# EAGLE board rt10 (EAGLE 9.6.2)
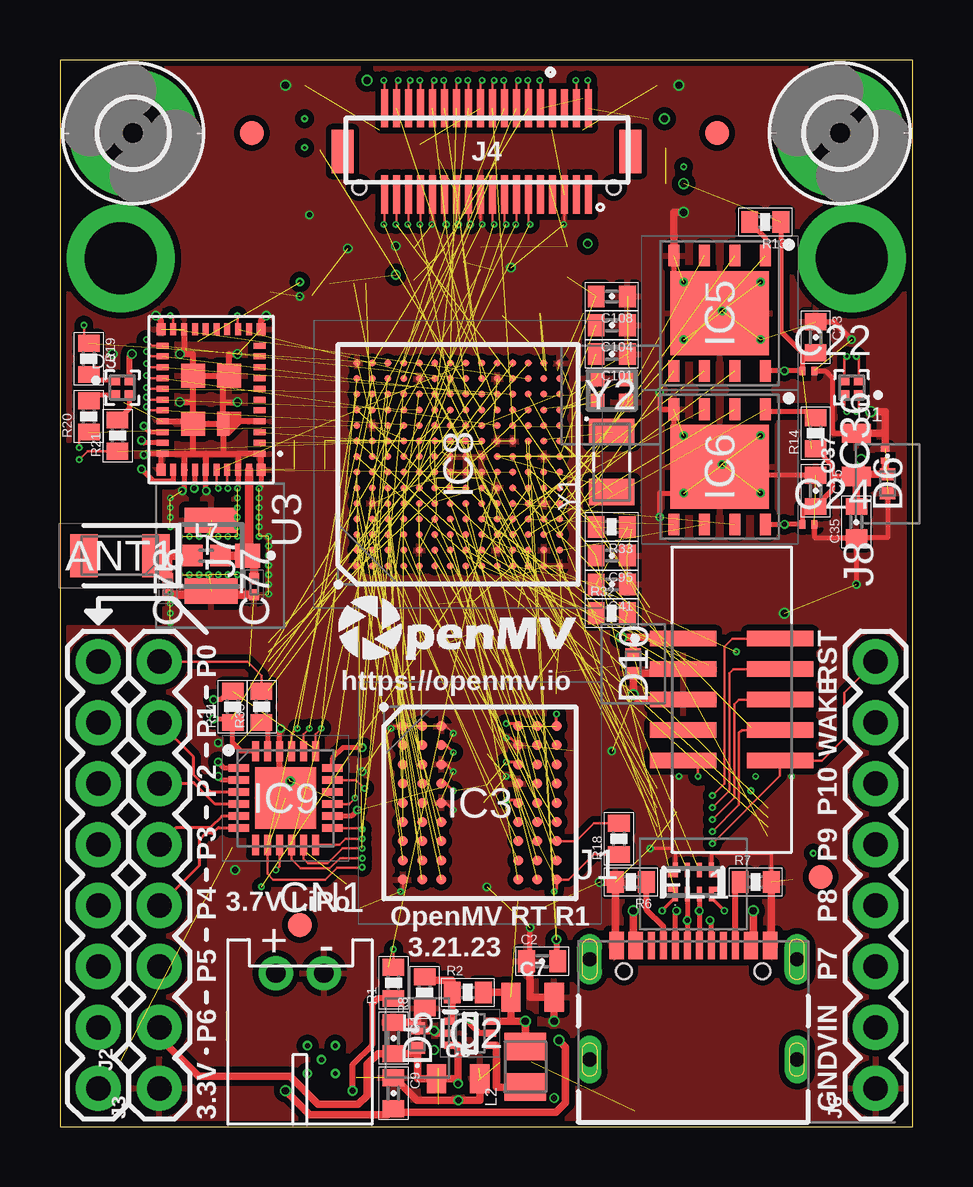
[diagram p5: board, top side]
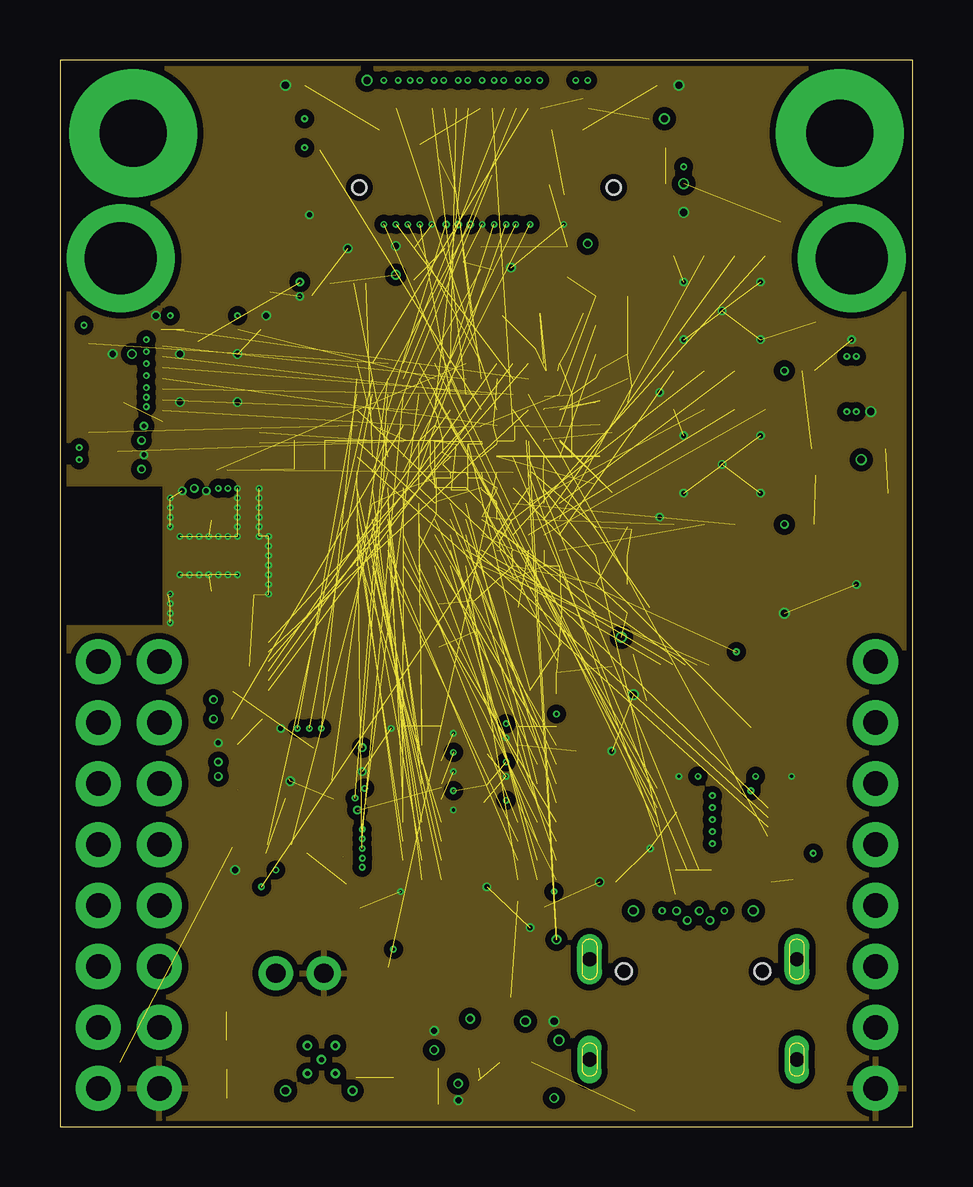
[diagram p6: board, inner layer GND]
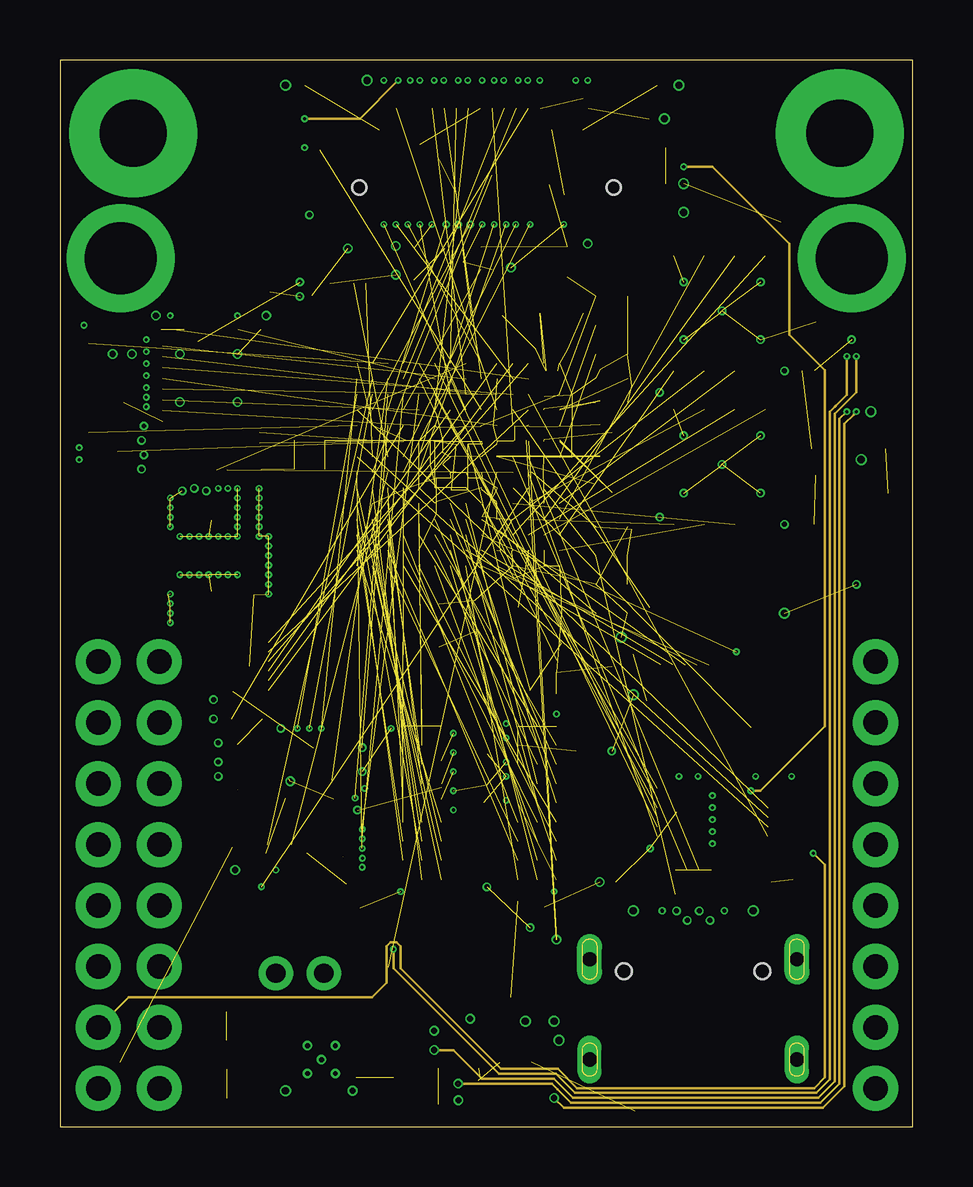
[diagram p7: board, inner layer Route3]
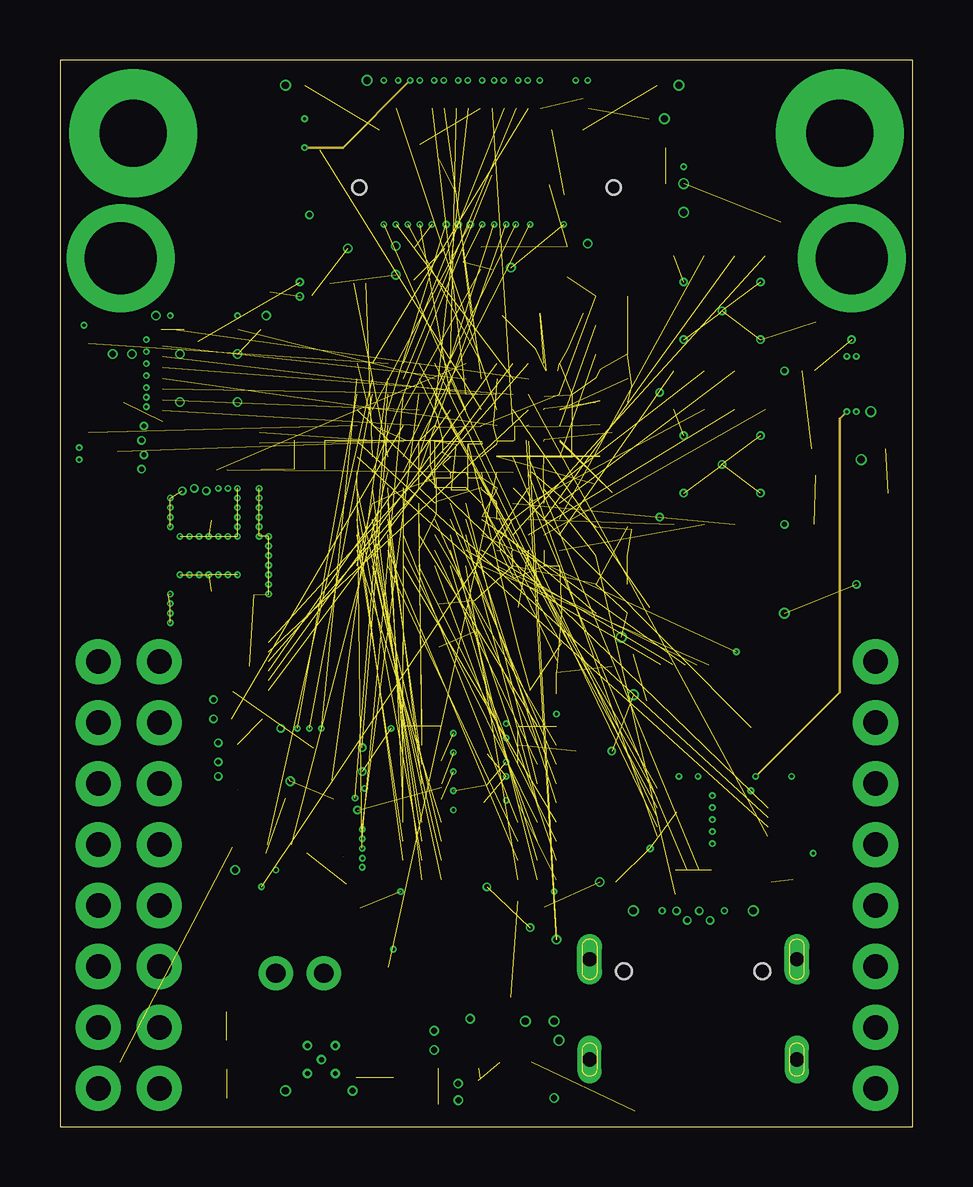
[diagram p8: board, inner layer Route14]
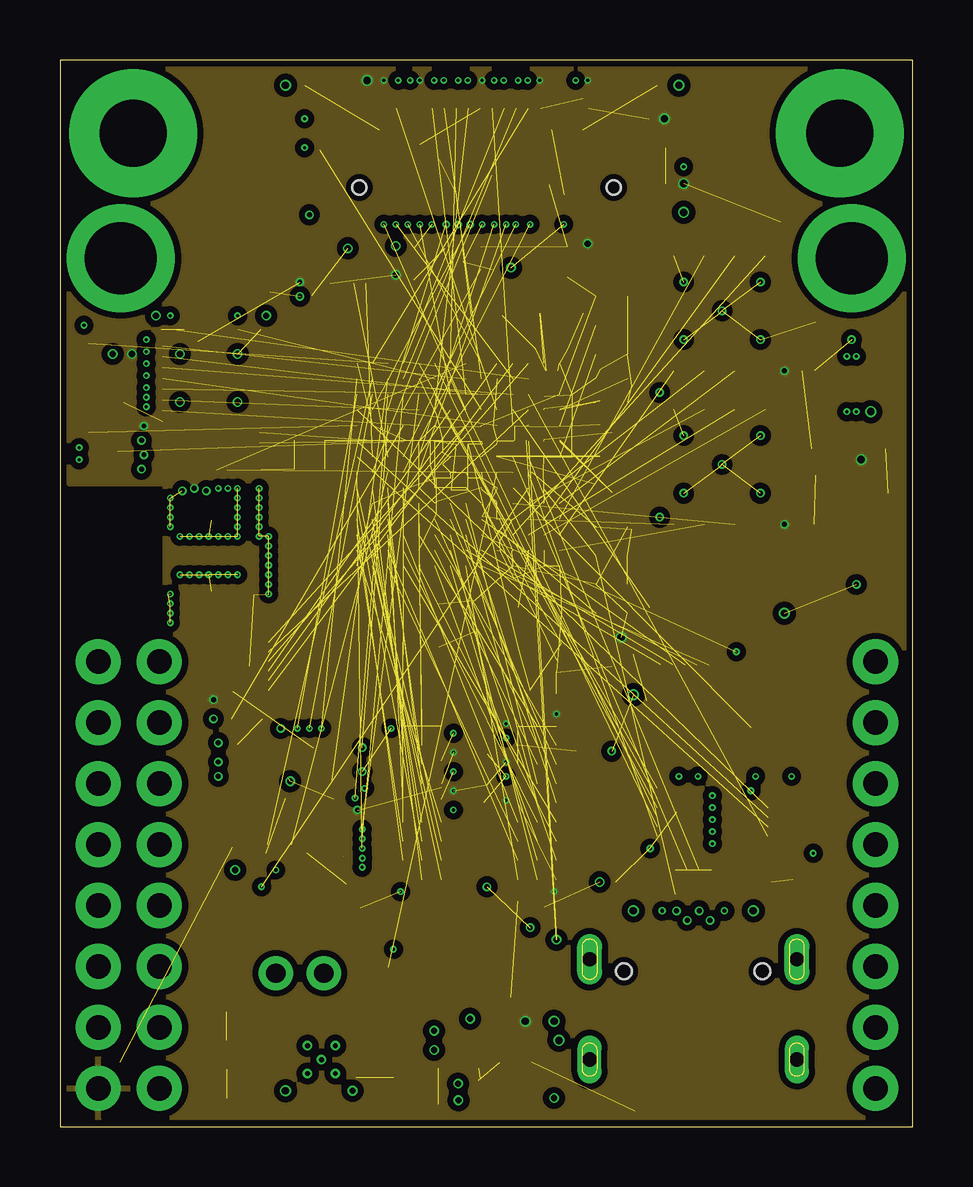
[diagram p9: board, inner layer VCC]
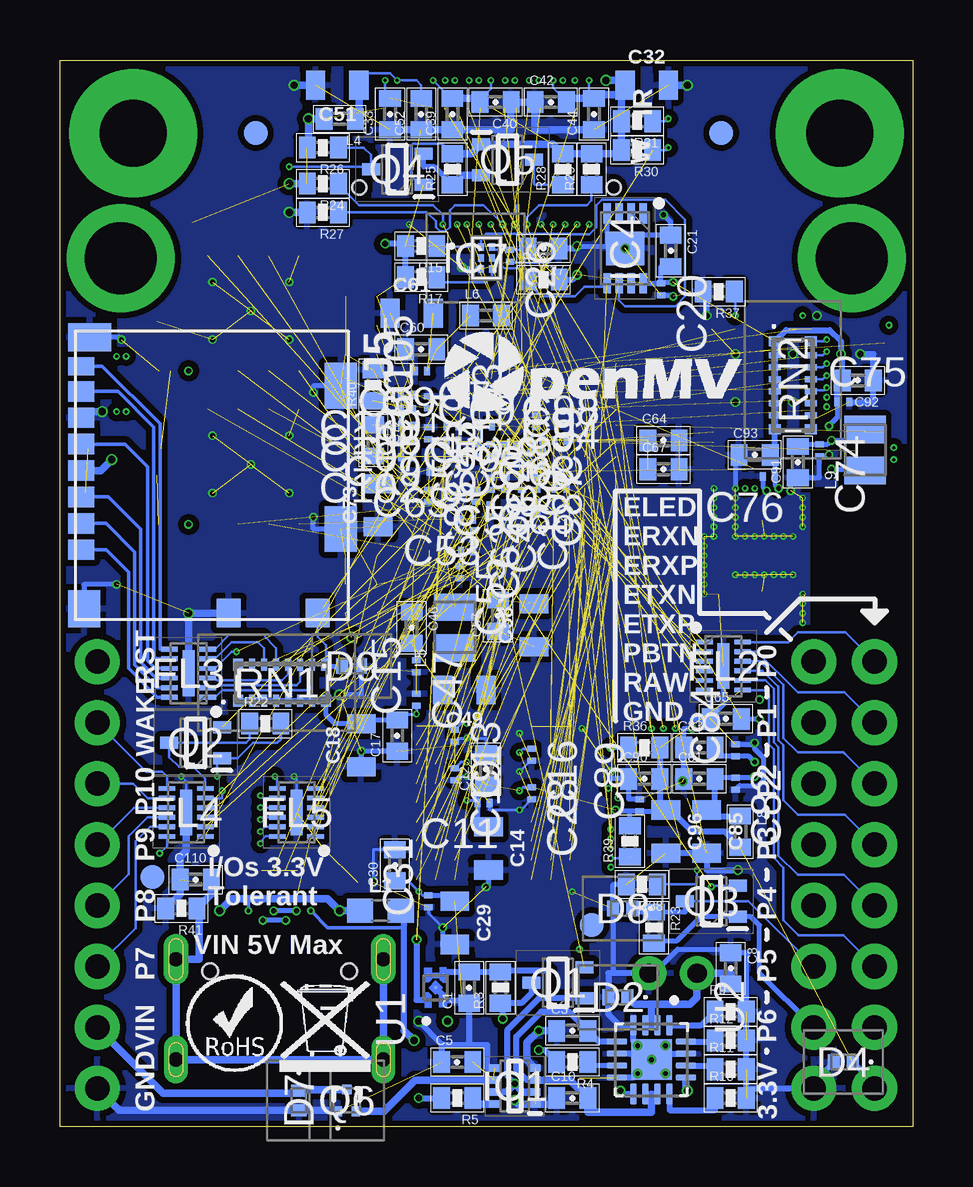
[diagram p10: board, bottom side, seen from below]

Size 35.56 x 44.45 mm. Coordinates in mm from the lower left corner, seen from the top.
Outline: 0,44.45 0,0 35.56,0 35.56,44.45 0,44.45
Copper layers (1*2*3*4*13*14*15*16): Top 0.035mm / dielectric 0.15mm / GND 0.035mm / dielectric 0.25mm / Route3 0.035mm / dielectric 0.15mm / Route4 0.035mm / dielectric 0.25mm / Route13 0.035mm / dielectric 0.15mm / Route14 0.035mm / dielectric 0.25mm / VCC 0.035mm / dielectric 0.15mm / Bottom 0.035mm
Design rules "MF_Ext_4_mil_drill_8_Layer *": minimum track width 3mil, minimum drill 4mil, track to track 3mil, track to pad 3mil, pad to pad 3mil, via to via 3mil, smd to smd 0mil, copper to edge 3mil, drill to drill 3mil, minimum pad ring 3mil, minimum via ring 3mil, stop-mask expansion 2mil, vias tented up to drill 25mil, thermal gap 10mil
Net classes: 0 default: width 0.102 mm, drill 0.127 mm, clearance 0.102 mm; 1 power: width 0.254 mm, drill 0.254 mm, clearance 0.102 mm; 2 gnd: width 0.102 mm, drill 0.127 mm, clearance 0.102 mm; 3 sdram: width 0.102 mm, drill 0.127 mm, clearance 0.102 mm; 4 jtag: width 0.102 mm, drill 0.127 mm, clearance 0.102 mm; 5 dcmi: width 0.102 mm, drill 0.127 mm, clearance 0.102 mm; 6 spi: width 0.102 mm, drill 0.127 mm, clearance 0.102 mm; 7 flash: width 0.102 mm, drill 0.127 mm, clearance 0.102 mm; 9 eth: width 0.102 mm, drill 0.127 mm, clearance 0.102 mm; 10 mdi: width 0.127 mm, drill 0.127 mm, clearance 0.102 mm; 11 wifi: width 0.102 mm, drill 0.127 mm, clearance 0.102 mm; 12 sdcard: width 0.102 mm, drill 0.127 mm, clearance 0.102 mm; 13 i2c: width 0.102 mm, drill 0.127 mm, clearance 0.102 mm; 14 mdio: width 0.102 mm, drill 0.127 mm, clearance 0.102 mm; 15 usb: width 0.102 mm, drill 0.127 mm, clearance 0.102 mm

## Footprints (pad centres in the part's own frame; a part is rotated, then mirrored left to right if it is on the bottom)
ANTC3216X140N = smd 1.15 x 1.8: 1 -1.5,0; 2 1.5,0
0402-CAP = smd 0.7 x 0.9: 1 -0.65,0; 2 0.65,0
0805 = smd 0.8 x 1.2: 1 -0.9,0; 2 0.9,0
C0201 = smd 0.25 x 0.35: 1 -0.25,0; 2 0.25,0
CAPC0603X33N = smd 0.46 x 0.42: 1 -0.33,0; 2 0.33,0
JST-PH-2-THM-RA = drill 0.8 pad 1.422: 1 1,0; 2 -1,0
LED_UHD1110-FKA-CL1A13R3Q1BBQFMF3 = smd 0.4 x 0.4: 1 -0.3,0.3; 2 -0.3,-0.3; 3 0.3,-0.3; 4 0.3,0.3
CPDQT5V0HEHF = smd 0.5 x 0.65: 1 -0.4,0; 2 0.4,0
FIDUCIAL-1X2 = smd 1 x 1: 1 0,0
ECMF024CMX8 = smd 0.2 x 0.6: 1 -0.75,-0.5; 2 -0.25,-0.5; 3 0.25,-0.5; 4 0.75,-0.5; 5 0.75,0.5; 6 0.25,0.5; 7 -0.25,0.5; 8 -0.75,0.5 | smd 0.2 x 0.2: 9 -0.95,0.3; 10 -0.95,-0.3; 11 0.95,-0.3; 12 0.95,0.3
SON40P150X250X65-13N = smd 0.7 x 0.2: 1 -0.8,1; 2 -0.8,0.6; 3 -0.8,0.2; 4 -0.8,-0.2; 5 -0.8,-0.6; 6 -0.8,-1; 7 0.8,-1; 8 0.8,-0.6; 9 0.8,-0.2; 10 0.8,0.2; 11 0.8,0.6; 12 0.8,1 | smd 0.5 x 1.9: 13 0,0
2,8-PAD = drill 2.8 pad 5.334: B2,8 0,0
SOTFL50P160X60-8N = smd 0.475 x 0.3: 1 -0.838,0.75; 2 -0.838,0.25; 3 -0.838,-0.25; 4 -0.838,-0.75; 5 0.838,-0.75; 6 0.838,-0.25; 7 0.838,0.25; 8 0.838,0.75
SOTFL50P162X60-6N = smd 0.492 x 0.3: 1 -0.834,0.5; 2 -0.834,0; 3 -0.834,-0.5; 4 0.834,-0.5; 5 0.834,0; 6 0.834,0.5
BGA54C80P9X9_800X800X120 = smd 0.41 x 0.41: A1 -3.2,3.2; A2 -2.4,3.2; A3 -1.6,3.2; A7 1.6,3.2; A8 2.4,3.2; A9 3.2,3.2; B1 -3.2,2.4; B2 -2.4,2.4; B3 -1.6,2.4; B7 1.6,2.4; B8 2.4,2.4; B9 3.2,2.4; C1 -3.2,1.6; C2 -2.4,1.6; C3 -1.6,1.6; C7 1.6,1.6; C8 2.4,1.6; C9 3.2,1.6; D1 -3.2,0.8; D2 -2.4,0.8; D3 -1.6,0.8; D7 1.6,0.8; D8 2.4,0.8; D9 3.2,0.8; E1 -3.2,0; E2 -2.4,0; E3 -1.6,0; E7 1.6,0; E8 2.4,0; E9 3.2,0; F1 -3.2,-0.8; F2 -2.4,-0.8; F3 -1.6,-0.8; F7 1.6,-0.8; F8 2.4,-0.8; F9 3.2,-0.8; G1 -3.2,-1.6; G2 -2.4,-1.6; G3 -1.6,-1.6; G7 1.6,-1.6; G8 2.4,-1.6; G9 3.2,-1.6; H1 -3.2,-2.4; H2 -2.4,-2.4; H3 -1.6,-2.4; H7 1.6,-2.4; H8 2.4,-2.4; H9 3.2,-2.4; J1 -3.2,-3.2; J2 -2.4,-3.2; J3 -1.6,-3.2; J7 1.6,-3.2; J8 2.4,-3.2; J9 3.2,-3.2
SON50P300X200X60-9N = smd 0.85 x 0.3: 1 -1.45,0.75; 2 -1.45,0.25; 3 -1.45,-0.25; 4 -1.45,-0.75; 5 1.45,-0.75; 6 1.45,-0.25; 7 1.45,0.25; 8 1.45,0.75 | smd 1.4 x 1.6: 9 0,0
SON127P500X595X80-9N = smd 0.9 x 0.45: 1 -2.4,1.905; 2 -2.4,0.635; 3 -2.4,-0.635; 4 -2.4,-1.905; 5 2.4,-1.905; 6 2.4,-0.635; 7 2.4,0.635; 8 2.4,1.905 | smd 3.5 x 4.1: 9 0,0
MXC4005XC = smd 0.25 x 0.3: 1 -0.22,0.46; 2 -0.22,0; 3 -0.22,-0.46; 4 0.22,-0.46; 5 0.22,0; 6 0.22,0.46
BGA196C65P14X14_1000X1000X143 = smd 0.29 x 0.29: A1 -4.225,4.225; A2 -3.575,4.225; A3 -2.925,4.225; A4 -2.275,4.225; A5 -1.625,4.225; A6 -0.975,4.225; A7 -0.325,4.225; A8 0.325,4.225; A9 0.975,4.225; A10 1.625,4.225; A11 2.275,4.225; A12 2.925,4.225; A13 3.575,4.225; A14 4.225,4.225; B1 -4.225,3.575; B2 -3.575,3.575; B3 -2.925,3.575; B4 -2.275,3.575; B5 -1.625,3.575; B6 -0.975,3.575; B7 -0.325,3.575; B8 0.325,3.575; B9 0.975,3.575; B10 1.625,3.575; B11 2.275,3.575; B12 2.925,3.575; B13 3.575,3.575; B14 4.225,3.575; C1 -4.225,2.925; C2 -3.575,2.925; C3 -2.925,2.925; C4 -2.275,2.925; C5 -1.625,2.925; C6 -0.975,2.925; C7 -0.325,2.925; C8 0.325,2.925; C9 0.975,2.925; C10 1.625,2.925; C11 2.275,2.925; C12 2.925,2.925; C13 3.575,2.925; C14 4.225,2.925; D1 -4.225,2.275; D2 -3.575,2.275; D3 -2.925,2.275; D4 -2.275,2.275; D5 -1.625,2.275; D6 -0.975,2.275; D7 -0.325,2.275; D8 0.325,2.275; D9 0.975,2.275; D10 1.625,2.275; D11 2.275,2.275; D12 2.925,2.275; D13 3.575,2.275; D14 4.225,2.275; E1 -4.225,1.625; E2 -3.575,1.625; E3 -2.925,1.625; E4 -2.275,1.625; E5 -1.625,1.625; E6 -0.975,1.625; E7 -0.325,1.625; E8 0.325,1.625; E9 0.975,1.625; E10 1.625,1.625; E11 2.275,1.625; E12 2.925,1.625; E13 3.575,1.625; E14 4.225,1.625; F1 -4.225,0.975; F2 -3.575,0.975; F3 -2.925,0.975; F4 -2.275,0.975; F5 -1.625,0.975; F6 -0.975,0.975; F7 -0.325,0.975; F8 0.325,0.975; F9 0.975,0.975; F10 1.625,0.975; F11 2.275,0.975; F12 2.925,0.975; F13 3.575,0.975; F14 4.225,0.975; G1 -4.225,0.325; G2 -3.575,0.325; G3 -2.925,0.325; G4 -2.275,0.325; G5 -1.625,0.325; G6 -0.975,0.325; G7 -0.325,0.325; G8 0.325,0.325; G9 0.975,0.325; G10 1.625,0.325; G11 2.275,0.325; G12 2.925,0.325; G13 3.575,0.325; G14 4.225,0.325; H1 -4.225,-0.325; H2 -3.575,-0.325; H3 -2.925,-0.325; H4 -2.275,-0.325; H5 -1.625,-0.325; H6 -0.975,-0.325; H7 -0.325,-0.325; H8 0.325,-0.325; H9 0.975,-0.325; H10 1.625,-0.325; H11 2.275,-0.325; H12 2.925,-0.325; H13 3.575,-0.325; H14 4.225,-0.325; J1 -4.225,-0.975; J2 -3.575,-0.975; J3 -2.925,-0.975; J4 -2.275,-0.975; J5 -1.625,-0.975; J6 -0.975,-0.975; J7 -0.325,-0.975; J8 0.325,-0.975; J9 0.975,-0.975; J10 1.625,-0.975; J11 2.275,-0.975; J12 2.925,-0.975; J13 3.575,-0.975; J14 4.225,-0.975; K1 -4.225,-1.625; K2 -3.575,-1.625; K3 -2.925,-1.625; K4 -2.275,-1.625; K5 -1.625,-1.625; K6 -0.975,-1.625; K7 -0.325,-1.625; K8 0.325,-1.625; K9 0.975,-1.625; K10 1.625,-1.625; K11 2.275,-1.625; K12 2.925,-1.625; K13 3.575,-1.625; K14 4.225,-1.625; L1 -4.225,-2.275; L2 -3.575,-2.275; L3 -2.925,-2.275; L4 -2.275,-2.275; L5 -1.625,-2.275; L6 -0.975,-2.275; L7 -0.325,-2.275; L8 0.325,-2.275; L9 0.975,-2.275; L10 1.625,-2.275; L11 2.275,-2.275; L12 2.925,-2.275; L13 3.575,-2.275; L14 4.225,-2.275; M1 -4.225,-2.925; M2 -3.575,-2.925; M3 -2.925,-2.925; M4 -2.275,-2.925; M5 -1.625,-2.925; M6 -0.975,-2.925; M7 -0.325,-2.925; M8 0.325,-2.925; M9 0.975,-2.925; M10 1.625,-2.925; M11 2.275,-2.925; M12 2.925,-2.925; M13 3.575,-2.925; M14 4.225,-2.925; N1 -4.225,-3.575; N2 -3.575,-3.575; N3 -2.925,-3.575; N4 -2.275,-3.575; N5 -1.625,-3.575; N6 -0.975,-3.575; N7 -0.325,-3.575; N8 0.325,-3.575; N9 0.975,-3.575; N10 1.625,-3.575; N11 2.275,-3.575; N12 2.925,-3.575; N13 3.575,-3.575; N14 4.225,-3.575; P1 -4.225,-4.225; P2 -3.575,-4.225; P3 -2.925,-4.225; P4 -2.275,-4.225; P5 -1.625,-4.225; P6 -0.975,-4.225; P7 -0.325,-4.225; P8 0.325,-4.225; P9 0.975,-4.225; P10 1.625,-4.225; P11 2.275,-4.225; P12 2.925,-4.225; P13 3.575,-4.225; P14 4.225,-4.225
QFN50P400X400X90-25N = smd 0.85 x 0.3: 1 -1.95,1.25; 2 -1.95,0.75; 3 -1.95,0.25; 4 -1.95,-0.25; 5 -1.95,-0.75; 6 -1.95,-1.25; 13 1.95,-1.25; 14 1.95,-0.75; 15 1.95,-0.25; 16 1.95,0.25; 17 1.95,0.75; 18 1.95,1.25 | smd 0.3 x 0.85: 7 -1.25,-1.95; 8 -0.75,-1.95; 9 -0.25,-1.95; 10 0.25,-1.95; 11 0.75,-1.95; 12 1.25,-1.95; 19 1.25,1.95; 20 0.75,1.95; 21 0.25,1.95; 22 -0.25,1.95; 23 -0.75,1.95; 24 -1.25,1.95 | smd 2.55 x 2.55: 25 0,0
GCT_USB4105-GF-A = smd 0.6 x 1.15: A1_B12 -3.2,4.755; A4_B9 -2.4,4.755; B1_A12 3.2,4.755; B4_A9 2.4,4.755 | smd 0.3 x 1.15: A5 -1.25,4.755; A6 -0.25,4.755; A7 0.25,4.755; A8 1.25,4.755; B5 1.75,4.755; B6 0.75,4.755; B7 -0.75,4.755; B8 -1.75,4.755 | drill 0.6 pad 1.05 long: S1 -4.32,4.18; S4 4.32,4.18 | drill 0.6 pad 1 long: S2 -4.32,0; S3 4.32,0 | hole 0.65: 2.89,3.68; -2.89,3.68
1X08 = drill 1.016 pad 1.88: 1 0,0; 2 2.54,0; 3 5.08,0; 4 7.62,0; 5 10.16,0; 6 12.7,0; 7 15.24,0; 8 17.78,0
DF12-36-DS = smd 0.3 x 1.6: 1 4.25,-1.8; 2 4.25,1.8; 3 3.75,-1.8; 4 3.75,1.8; 5 3.25,-1.8; 6 3.25,1.8; 7 2.75,-1.8; 8 2.75,1.8; 9 2.25,-1.8; 10 2.25,1.8; 11 1.75,-1.8; 12 1.75,1.8; 13 1.25,-1.8; 14 1.25,1.8; 15 0.75,-1.8; 16 0.75,1.8; 17 0.25,-1.8; 18 0.25,1.8; 19 -0.25,-1.8; 20 -0.25,1.8; 21 -0.75,-1.8; 22 -0.75,1.8; 23 -1.25,-1.8; 24 -1.25,1.8; 25 -1.75,-1.8; 26 -1.75,1.8; 27 -2.25,-1.8; 28 -2.25,1.8; 29 -2.75,-1.8; 30 -2.75,1.8; 31 -3.25,-1.8; 32 -3.25,1.8; 33 -3.75,-1.8; 34 -3.75,1.8; 35 -4.25,-1.8; 36 -4.25,1.8 | smd 0.9 x 1.8: F1 6,0; F2 -6,0 | hole 0.6: 5.3,-1.5; -5.3,-1.5
1040310811 = smd 1.2 x 1: CD$1 11.74,10.1; CD$2 11.74,6.4 | smd 1.55 x 1.35: G$1 11.565,0.375 | smd 1.17 x 1.8: G$2 0.245,0.6 | smd 1.9 x 1.35: G$3 2.27,11.075; G$4 8.24,11.075 | smd 0.85 x 1.1: P$1 9.105,0.25; P$2 8.005,0.25; P$3 6.905,0.25; P$4 5.805,0.25; P$5 4.705,0.25; P$6 3.605,0.25; P$7 2.505,0.25 | smd 0.75 x 1.1: P$8 1.455,0.25
23370191 = smd 1 x 1.05: 1 0,-1.525 | smd 1.05 x 2.2: 2 -1.475,0; 3 1.475,0
CNC_3221-10-0300-00 = smd 0.65 x 2.76: 1 -2.54,-2.02; 2 -2.54,2.02; 3 -1.27,-2.02; 4 -1.27,2.02; 5 0,-2.02; 6 0,2.02; 7 1.27,-2.02; 8 1.27,2.02; 9 2.54,-2.02; 10 2.54,2.02
0603 = smd 1.1 x 1: 1 -0.85,0; 2 0.85,0
INDC2016X100N = smd 1.14 x 1.73: 1 -0.847,0; 2 0.847,0
C0402 = smd 0.7 x 0.9: 1 -0.65,0; 2 0.65,0
0402 = smd 0.85 x 0.9: 1 -0.58,0; 2 0.58,0
9774030151R = drill 3 pad 4.5: P$1 0,0
SOT65P210X110-3N = smd 0.75 x 0.5: 1 -1.1,0.65; 2 -1.1,-0.65; 3 1.1,0
PMXB120EPEZ = smd 0.35 x 0.4: 1 -0.375,-0.45; 2 0.375,-0.45 | smd 0.4 x 0.4: 3 0,0.45
0402-RES = smd 0.7 x 0.9: 1 -0.65,0; 2 0.65,0
EXB2HV104JV = smd 0.425 x 0.5: 1 -1.837,-0.75; 8 1.837,-0.75; 9 1.837,0.75; 16 -1.837,0.75 | smd 0.25 x 0.5: 2 -1.25,-0.75; 3 -0.75,-0.75; 4 -0.25,-0.75; 5 0.25,-0.75; 6 0.75,-0.75; 7 1.25,-0.75; 10 1.25,0.75; 11 0.75,0.75; 12 0.25,0.75; 13 -0.25,0.75; 14 -0.75,0.75; 15 -1.25,0.75
VREG_MIC5365-3.3YMT-TZ = smd 0.1 x 0.1: 1 -0.521,0.312; 2 -0.521,-0.312; 3 0.521,-0.312; 4 0.521,0.312; EP 0,0
QFN50P300X300X100-17N = smd 0.86 x 0.26: 1 -1.435,0.75; 2 -1.435,0.25; 3 -1.435,-0.25; 4 -1.435,-0.75; 9 1.435,-0.75; 10 1.435,-0.25; 11 1.435,0.25; 12 1.435,0.75 | smd 0.26 x 0.86: 5 -0.75,-1.435; 6 -0.25,-1.435; 7 0.25,-1.435; 8 0.75,-1.435; 13 0.75,1.435; 14 0.25,1.435; 15 -0.25,1.435; 16 -0.75,1.435 | smd 1.68 x 1.68: 17 0,0 | drill 0.2 pad 0.4: 18 0,0; 19 -0.58,0.58; 20 0.58,0.58; 21 -0.58,-0.58; 22 0.58,-0.58
XCVR_LBEE5KL1DX-TEMP = smd 0.5 x 0.25: 1 -2.025,2.25; 2 -2.025,1.8; 3 -2.025,1.35; 4 -2.025,0.9; 5 -2.025,0.45; 6 -2.025,0; 7 -2.025,-0.45; 8 -2.025,-0.9; 9 -2.025,-1.35; 10 -2.025,-1.8; 11 -2.025,-2.25; 22 2.025,-2.25; 23 2.025,-1.8; 24 2.025,-1.35; 25 2.025,-0.9; 26 2.025,-0.45; 27 2.025,0; 28 2.025,0.45; 29 2.025,0.9; 30 2.025,1.35; 31 2.025,1.8; 32 2.025,2.25 | smd 0.375 x 0.5: 12 -2.087,-2.925; 21 2.087,-2.925; 33 2.087,2.925; 42 -2.087,2.925 | smd 0.25 x 0.5: 13 -1.575,-2.925; 14 -1.125,-2.925; 15 -0.675,-2.925; 16 -0.225,-2.925; 17 0.225,-2.925; 18 0.675,-2.925; 19 1.125,-2.925; 20 1.575,-2.925; 34 1.575,2.925; 35 1.125,2.925; 36 0.675,2.925; 37 0.225,2.925; 38 -0.225,2.925; 39 -0.675,2.925; 40 -1.125,2.925; 41 -1.575,2.925 | smd 0.5 x 1: 43 -0.5,1 | smd 1 x 1: 44 -0.75,-1; 45 0.75,1; 46 0.75,-1
XTAL_ABS07-32.768KHZ-7-T = smd 1.1 x 1.9: 1 -1.25,0; 2 1.25,0
XRCGB24M000F3M00R0 = smd 0.75 x 0.7: 1 -0.675,-0.5; 2 0.675,-0.5; 3 0.675,0.5; 4 -0.675,0.5

## Placement (x,y rotation side)
ANT1  AMCA31-2R450G-S1F-T3  [ANTC3216X140N]  2.5,23.8 180 top
C1  4.7uF  [0402-CAP]  18.5,5.8 90 bottom
C2  4.7uF  [0402-CAP]  20.1,6.9 0 top
C3  4.7uF  [0402-CAP]  14.2,4 0 bottom
C4  4.7uF  [0402-CAP]  13.9,3.7 270 top
C5  4.7uF  [0402-CAP]  19,2.7 0 bottom
C6  22uF  [0805]  16.6,2 0 top
C7  22uF  [0805]  19.7,5.4 0 top
C8  4.7uF  [0402-CAP]  7.6,6.6 270 bottom
C9  4.7uF  [0402-CAP]  13.9,1.4 270 top
C10  4.7uF  [0402-CAP]  14.2,1.2 0 bottom
C11  0.22uF  [C0201]  17.9,13.5 180 bottom
C12  4.7uF  [0402-CAP]  17.8,14.9 90 bottom
C13  0.22uF  [C0201]  19.1,16.3 270 bottom
C14  22uF  [0805]  17.7,11.6 270 bottom
C15  0.22uF  [C0201]  20.7,17.8 90 bottom
C16  0.22uF  [C0201]  15.9,15.5 270 bottom
C17  4.7uF  [0402-CAP]  21.5,16.3 90 bottom
C18  22uF  [0805]  23,15.9 90 bottom
C19  0.22uF  [C0201]  19.1,14.7 270 bottom
C20  0.22uF  [C0201]  10.5,34.9 270 bottom
C21  4.7uF  [0402-CAP]  10.1,36.5 270 bottom
C22  0.22uF  [C0201]  31.2,31.5 0 top
C23  4.7uF  [0402-CAP]  31.5,32.9 270 top
C24  0.22uF  [C0201]  31.2,25.1 0 top
C25  4.7uF  [0402-CAP]  31.5,26.5 270 top
C26  0.22uF  [C0201]  16.8,36.3 270 bottom
C27  4.7uF  [0402-CAP]  15.4,36.6 180 bottom
C28  0.22uF  [C0201]  15.9,13.9 270 bottom
C29  22uF  [0805]  19.1,8.5 270 bottom
C30  4.7uF  [0402-CAP]  21.6,10.9 90 bottom
C31  0.22uF  [C0201]  20.2,9.4 90 bottom
C32  22uF  [0805]  11.1,43.4 0 bottom
C33  4.7uF  [0402-CAP]  21.8,42.2 90 bottom
C34  0.22uF  [C0201]  17,26.8 90 bottom
C35  4.7uF  [0402-CAP]  33.2,25.2 90 top
C36  0.22uF  [C0201]  34.4,28 90 top
C37  22uF  [0805]  33.2,28 90 top
C38  0.22uF  [C0201]  17,28.2 270 bottom
C39  4.7uF  [0402-CAP]  19.2,42.2 90 bottom
C40  4.7uF  [0402-CAP]  17.4,42.7 180 bottom
C41  4.7uF  [0402-CAP]  23,22.6 180 top
C42  4.7uF  [0402-CAP]  15.1,42.7 0 bottom
C43  0.22uF  [C0201]  17.6,26.8 90 bottom
C44  4.7uF  [0402-CAP]  13.3,42.2 90 bottom
C45  0.22uF  [C0201]  17.6,28.2 270 bottom
C46  4.7uF  [0402-CAP]  20.9,20.8 270 bottom
C47  0.22uF  [C0201]  20.7,19.2 270 bottom
C48  0.22uF  [C0201]  17.6,25.7 270 bottom
C49  22uF  [0805]  18.7,18.2 180 bottom
C50  0.22uF  [C0201]  17.8,29.2 180 bottom
C51  22uF  [0805]  24,43.4 180 bottom
C52  4.7uF  [0402-CAP]  20.5,42.2 90 bottom
C53  0.22uF  [C0201]  18.6,25.3 180 bottom
C54  0.22uF  [C0201]  18.2,26.3 90 bottom
C55  0.22uF  [C0201]  18.9,23.1 270 bottom
C56  0.22uF  [C0201]  18.6,24 0 bottom
C57  4.7uF  [0402-CAP]  17.3,21.3 90 bottom
C58  22uF  [0805]  15.8,20.9 90 bottom
C59  0.22uF  [C0201]  20.5,31.5 180 bottom
C60  4.7uF  [0402-CAP]  20.5,32.4 0 bottom
C61  22uF  [0805]  20.9,33.9 0 bottom
C62  0.22uF  [C0201]  18.3,24.6 270 bottom
C63  0.22uF  [C0201]  19.9,27.3 180 bottom
C64  4.7uF  [0402-CAP]  10.4,28.6 0 bottom
C65  4.7uF  [0402-CAP]  7.8,17 0 bottom
C66  0.22uF  [C0201]  14.7,26.6 180 bottom
C67  4.7uF  [0402-CAP]  10.4,27.4 0 bottom
C68  0.22uF  [C0201]  14.7,28.6 180 bottom
C69  0.22uF  [C0201]  19.2,28.6 0 bottom
C70  0.22uF  [C0201]  19.2,29.2 0 bottom
C71  0.22uF  [C0201]  18.2,28.2 90 bottom
C72  4.7uF  [0402-CAP]  22.5,28.6 270 bottom
C73  22uF  [0805]  22.3,25.9 90 bottom
C74  0.22uF  [C0201]  3.9,28.2 270 bottom
C75  0.22uF  [C0201]  2.9,30.2 0 bottom
C76  0.22uF  [C0201]  6,27.1 180 bottom
C77  GRM0335C1H1R5BA01D  [CAPC0603X33N]  8.1,22.5 270 top
C78  DNP  [CAPC0603X33N]  4.5,22.5 270 top
C79  18pF  [C0201]  21.1,28.6 180 bottom
C80  18pF  [C0201]  20.2,28.9 90 bottom
C81  4.7uF  [0402-CAP]  8.9,14.5 0 bottom
C82  0.22uF  [C0201]  7.4,14.3 270 bottom
C83  4.7uF  [0402-CAP]  8.9,15.8 0 bottom
C84  0.22uF  [C0201]  7.4,15.7 90 bottom
C85  22uF  [0805]  8.6,12.3 270 bottom
C86  0.22uF  [C0201]  15.7,25.8 90 bottom
C87  0.22uF  [C0201]  15.7,26.8 270 bottom
C88  0.22uF  [C0201]  20.2,26.3 270 bottom
C89  0.22uF  [C0201]  11.4,13.4 90 bottom
C90  4.7uF  [0402-CAP]  11.2,14.5 0 bottom
C91  4.7uF  [0402-CAP]  4.8,27.7 90 bottom
C92  4.7uF  [0402-CAP]  2.3,31.1 180 bottom
C93  4.7uF  [0402-CAP]  6.6,28 0 bottom
C94  0.22uF  [C0201]  15.7,27.6 0 bottom
C95  4.7uF  [0402-CAP]  23,23.8 180 top
C96  22uF  [0805]  10.3,12.3 270 bottom
C97  0.22uF  [C0201]  15.7,28.1 0 bottom
C98  0.22uF  [C0201]  15.7,28.6 0 bottom
C99  0.22uF  [C0201]  15.7,29.4 270 bottom
C100  0.22uF  [C0201]  16.3,26.8 270 bottom
C101  4.7uF  [0402-CAP]  23,32.2 180 top
C102  0.22uF  [C0201]  21.1,27.9 180 bottom
C103  0.22uF  [C0201]  16.5,28.2 90 bottom
C104  4.7uF  [0402-CAP]  23,33.4 180 top
C105  4.7pF  [C0201]  20.2,30.2 90 bottom
C106  4.7pF  [C0201]  21.1,29.9 180 bottom
C107  0.22uF  [C0201]  21.1,29.2 180 bottom
C108  4.7uF  [0402-CAP]  23,34.6 180 top
C109  0.22uF  [C0201]  21.1,30.5 180 bottom
C110  1nF  [0402-CAP]  29.9,10.3 0 bottom
CN1  S2B-PH-K-S(LF)(SN)  [JST-PH-2-THM-RA]  10,6.4 180 top
D1  UHD1110-FKA-CL1A13R3Q1BBQFMF3  [LED_UHD1110-FKA-CL1A13R3Q1BBQFMF3]  33,30.8 180 top
D2  CPDQT5V0HE-HF  [CPDQT5V0HEHF]  12.3,5.4 180 bottom
D3  UHD1110-FKA-CL1A13R3Q1BBQFMF3  [LED_UHD1110-FKA-CL1A13R3Q1BBQFMF3]  2.6,30.8 0 top
D4  CPDQT5V0HE-HF  [CPDQT5V0HEHF]  2.9,2.7 180 bottom
D5  CPDQT5V0HE-HF  [CPDQT5V0HEHF]  14.9,3.7 90 top
D6  CPDQT5V0HE-HF  [CPDQT5V0HEHF]  34.5,26.8 270 top
D7  CPDQT5V0HE-HF  [CPDQT5V0HEHF]  25.6,1.1 270 bottom
D8  CPDQT5V0HE-HF  [CPDQT5V0HEHF]  12.1,9.1 180 bottom
D9  CPDQT5V0HE-HF  [CPDQT5V0HEHF]  23.4,19.2 0 bottom
D10  CPDQT5V0HE-HF  [CPDQT5V0HEHF]  23.9,19.3 270 top
FD1  FIDUCIAL1X2  [FIDUCIAL-1X2]  10,8.4 0 top
FD2  FIDUCIAL1X2  [FIDUCIAL-1X2]  31.7,10.4 0 top
FD3  FIDUCIAL1X2  [FIDUCIAL-1X2]  8,41.4 0 bottom
FD4  FIDUCIAL1X2  [FIDUCIAL-1X2]  31.7,10.4 0 bottom
FD5  FIDUCIAL1X2  [FIDUCIAL-1X2]  27.4,41.4 0 top
FD6  FIDUCIAL1X2  [FIDUCIAL-1X2]  8,41.4 0 top
FD7  FIDUCIAL1X2  [FIDUCIAL-1X2]  27.4,41.4 0 bottom
FD8  FIDUCIAL1X2  [FIDUCIAL-1X2]  13.4,8.4 0 bottom
FL1  ECMF02-4CMX8  [ECMF024CMX8]  26.4,10.2 0 top
FL2  EMIF06-1005M12  [SON40P150X250X65-13N]  7.9,19.2 0 bottom
FL3  EMIF06-1005M12  [SON40P150X250X65-13N]  30.2,18.9 180 bottom
FL4  EMIF06-1005M12  [SON40P150X250X65-13N]  30.3,13.1 180 bottom
FL5  EMIF06-1005M12  [SON40P150X250X65-13N]  25.7,13.1 180 bottom
H1  MOUNT-PAD-ROUND2.8  [2,8-PAD]  3.05,41.4 90 top
H2  MOUNT-PAD-ROUND2.8  [2,8-PAD]  32.51,41.4 270 top
IC1  LM66200DRLR  [SOTFL50P160X60-8N]  16.6,1.7 180 bottom
IC2  AP61300Z6-7  [SOTFL50P162X60-6N]  17.1,3.9 0 top
IC3  IS42S16160G-6BL  [BGA54C80P9X9_800X800X120]  17.5,13.5 0 top
IC4  ATECC608B-MAHDA-T  [SON50P300X200X60-9N]  12,36.6 270 bottom
IC5  IS25LP064D-JKLE-TR  [SON127P500X595X80-9N]  27.5,33.9 270 top
IC6  IS25LP128F-JKLE-TR  [SON127P500X595X80-9N]  27.5,27.5 270 top
IC7  MXC4005XC  [MXC4005XC]  17.78,36.2 0 bottom
IC8  MIMXRT1052DVL6B  [BGA196C65P14X14_1000X1000X143]  16.6,27.6 90 top
IC9  KSZ8081RNDCA-TR  [QFN50P400X400X90-25N]  9.4,13.7 0 top
J1  USB4105-GF-A  [GCT_USB4105-GF-A]  26.4,2.8 0 top
J2  DNP  [1X08]  1.6,1.6 90 top
J3  DNP  [1X08]  4.14,1.6 90 top
J4  DF12-36-DS  [DF12-36-DS]  17.78,40.64 0 top
J5  USD-1040310811  [1040310811]  34.92,33.15 270 bottom
J6  DNP  [1X08]  34,1.6 90 top
J7  DNP  [23370191]  6.3,23.8 90 top
J8  3221-10-0300-00  [CNC_3221-10-0300-00]  28,17.8 270 top
L1  100  [0603]  22.2,9 0 bottom
L2  MAKK2016T1R0M  [INDC2016X100N]  19.4,2.5 90 top
L4  100  [C0402]  23.9,42 180 bottom
L5  MAKK2016T4R7M  [INDC2016X100N]  19.1,20.8 90 bottom
L6  100  [C0402]  17.8,33.8 0 bottom
L7  3.9NH  [0402]  6.1,23.8 0 top
L8  100  [C0402]  7.2,12.3 270 bottom
L9  MAKK2016T2R2M  [INDC2016X100N]  2,28.2 90 bottom
M1  9774030151R  [9774030151R]  33.02,36.2 0 top
M2  9774030151R  [9774030151R]  2.54,36.2 0 top
Q1  2N7002KW_R1_00001  [SOT65P210X110-3N]  14.8,6 180 bottom
Q2  2N7002KW_R1_00001  [SOT65P210X110-3N]  29.9,16 180 bottom
Q3  2N7002KW_R1_00001  [SOT65P210X110-3N]  8.4,9.4 180 bottom
Q4  2N7002KW_R1_00001  [SOT65P210X110-3N]  21.5,39.9 180 bottom
Q5  2N7002KW_R1_00001  [SOT65P210X110-3N]  16.9,40.3 0 bottom
Q6  PMXB120EPEZ  [PMXB120EPEZ]  23.6,1.1 0 bottom
R1  1K  [0402-RES]  13.9,6 90 top
R2  200K  [0402-RES]  17,5.6 0 top
R3  100K  [0402-RES]  17.2,5.8 90 bottom
R4  1K  [0402-RES]  14.2,2.7 180 bottom
R5  1K  [0402-RES]  19,1.2 180 bottom
R6  5.1K  [0402-RES]  23.8,10.2 180 top
R7  5.1K  [0402-RES]  29,10.2 0 top
R8  44.2K  [0402-RES]  15.2,5.6 90 top
R9  10K  [0402-RES]  7.6,4.8 0 bottom
R10  3.3K  [0402-RES]  7.6,1.2 0 bottom
R11  46.4K  [0402-RES]  7.6,2.4 0 bottom
R12  8.2K  [0402-RES]  7.6,3.6 0 bottom
R13  100K  [0402-RES]  29.4,37.7 180 top
R14  100K  [0402-RES]  31.5,28.9 90 top
R15  2.7K  [0402-RES]  20.5,36.7 180 bottom
R16  2.7K  [0402-RES]  15.4,35.3 0 bottom
R17  2.7K  [0402-RES]  20.5,35.4 180 bottom
R18  100K  [0402-RES]  23.3,12 90 top
R19  220  [0402-RES]  1.2,32 270 top
R20  220  [0402-RES]  1.2,29.6 90 top
R21  220  [0402-RES]  2.4,28.8 90 top
R22  100K  [0402-RES]  27,16.8 0 bottom
R23  100K  [0402-RES]  10.8,8.3 270 bottom
R24  100K  [0402-RES]  24.6,39.3 180 bottom
R25  100K  [0402-RES]  19.2,39.9 90 bottom
R26  1K  [0402-RES]  24.6,40.8 180 bottom
R27  100K  [0402-RES]  24.6,38.1 180 bottom
R28  100K  [0402-RES]  14.6,39.9 90 bottom
R29  100K  [0402-RES]  13.4,39.9 90 bottom
R30  4.7K  [0402-RES]  11.5,40.7 180 bottom
R31  4.7K  [0402-RES]  11.5,41.9 180 bottom
R32  30K  [0402-RES]  23,21.4 0 top
R33  10K  [0402-RES]  23,25 180 top
R34  100K  [0402-RES]  7.2,17.5 90 top
R35  220  [0402-RES]  8.4,17.5 90 top
R36  1K  [0402-RES]  11.2,15.8 0 bottom
R37  10K  [0402-RES]  8.1,34.8 180 bottom
R38  6.49K  [0402-RES]  11.3,10.1 180 bottom
R39  1K  [0402-RES]  11.8,11.9 90 bottom
R40  2.2M  [0402-RES]  22.5,30.9 90 bottom
R41  1M  [0402-RES]  30.5,9.1 180 bottom
RN1  EXB-2HV104JV  [EXB2HV104JV]  26.3,18.5 0 bottom
RN2  EXB-2HV104JV  [EXB2HV104JV]  5,30.9 270 bottom
U1  MIC5365-3.3YMT-TZ  [VREG_MIC5365-3.3YMT-TZ]  19.9,5.8 90 bottom
U2  BQ24075RGTR  [QFN50P300X300X100-17N]  10.9,2.8 270 bottom
U3  LBEE5KL1DX-883  [XCVR_LBEE5KL1DX-TEMP]  6.3,30.3 180 top
U$1  [WEEE]  26.4,2.3 0 bottom
U$2  [ROHS]  30.3,2.3 0 bottom
U$3  [OMV-LOGO]  19.68,29.59 0 bottom
U$4  [OMV-LOGO-SMALL]  11.5,19.3 0 top
Y1  SC32S-7PF20PPM  [XTAL_ABS07-32.768KHZ-7-T]  23,27.7 90 top
Y2  XRCGB24M000F3M00R0  [XRCGB24M000F3M00R0]  23,30.7 0 top

## Tracks (layer width: path | path; a pad name or v marks a point on that pad's centre or on a via)
ANT
  Top 0.35: U3.41 7.88,23.85 J7.1 | J7.1 L7.2 | J7.1 8.1,23.52 C77.1
BAT
  Bottom 0.254: U2.2 10.9,4.24 U2.3
  Bottom 0.305: C8.2 7.6,6.4 CN1.1 9,5.4 9.3,5.1 10.9,5.1 | 10.9,5.1 10.9,4.24 | D2.1 11.6,5.1 10.9,5.1
BT_D_WAKE  (via drill 0.13)  (1 unrouted)
  Top 0.102: U3.39 6.97,26.62 v7,26.6
BT_H_WAKE  (via drill 0.13)  (1 unrouted)
  Top 0.102: U3.38 6.53,26.68 v6.6,26.6
BT_REG_ON  (via drill 0.13)  (1 unrouted)
  Top 0.102: U3.14 7.4,33.25 v7.4,33.8
  Bottom 0.102: R37.1 7.4,34.75 v7.4,33.8
BT_UART_RX  (1 unrouted)
BT_UART_TX  (1 unrouted)
CC1
  Top 0.254: J1.A5 25.15,8.35 24.45,9.05 R6.1
CC2
  Top 0.254: J1.B5 28.15,10 R7.1
CHG  (via drill 0.25)
  Top 0.254: v12.2,1.5 12.2,2.6 13,3.4 13,5.1 13.25,5.35 R1.1
  Bottom 0.254: U2.9 12.06,1.36 v12.2,1.5
D_N  (via drill 0.2)
  Top 0.203: FL1.3 v26.65,9 J1.A7 | J1.B7 25.65,8.95 v25.7,9
  Bottom 0.203: v25.7,9 v26.65,9
D_P  (via drill 0.2)
  Top 0.203: FL1.2 v26.15,8.6 J1.A6 | J1.B6 27.15,8.55 v27.1,8.6
  Bottom 0.203: v26.15,8.6 v27.1,8.6
DCDC_LP  (2 unrouted)
DCDC_PSWITCH  (2 unrouted)
DCMI_CLK  (via drill 0.13)  (1 unrouted)
  Top 0.102: J4.12 19.53,43.57 v19.5,43.6
DCMI_D0  (via drill 0.13)  (1 unrouted)
  Top 0.102: J4.31 14.53,37.63 v14.5,37.6
DCMI_D1  (via drill 0.13)  (1 unrouted)
  Top 0.102: J4.29 15.03,37.63 v15,37.6
DCMI_D2  (via drill 0.13)  (1 unrouted)
  Top 0.102: J4.35 13.53,37.63 v13.5,37.6
DCMI_D3  (via drill 0.13)  (1 unrouted)
  Top 0.102: J4.28 15.53,43.53 v15.6,43.6
DCMI_D4  (via drill 0.13)  (1 unrouted)
  Top 0.102: J4.26 16.03,43.57 v16,43.6
DCMI_D5  (via drill 0.13)  (1 unrouted)
  Top 0.102: J4.33 14.03,37.63 v14,37.6
DCMI_D6  (via drill 0.13)  (1 unrouted)
  Top 0.102: J4.24 16.53,43.53 v16.6,43.6
DCMI_D7  (via drill 0.13)  (1 unrouted)
  Top 0.102: J4.22 17.03,43.57 v17,43.6
DCMI_FSIN  (via drill 0.15)  (1 unrouted)
  Top 0.102: J4.23 16.53,37.67 v16.6,37.6
  Bottom 0.102: Q5.3 15.8,39.3 15.75,39.25 R28.1 | v16.6,37.6 16.5,37.7 16.5,38.4
DCMI_HSYNC  (via drill 0.13)  (1 unrouted)
  Top 0.102: J4.18 18.03,43.53 v18.1,43.6
DCMI_MISO  (via drill 0.13)  (1 unrouted)
  Top 0.102: J4.15 18.53,37.67 v18.6,37.6
DCMI_MOSI  (via drill 0.13)  (1 unrouted)
  Top 0.102: J4.17 18.03,37.67 v18.1,37.6
DCMI_PCLK  (via drill 0.13)  (1 unrouted)
  Top 0.102: J4.14 19.03,43.53 v19.1,43.6
DCMI_PWDN  (via drill 0.15)  (1 unrouted)
  Top 0.102: J4.25 16.03,37.67 v16.1,37.6
  Bottom 0.102: R29.1 13.4,38.6 13.6,38.4 15.6,38.4 16.1,37.9 v16.1,37.6
DCMI_RST  (via drill 0.15)  (1 unrouted)
  Top 0.102: J4.21 17.03,37.67 v17.1,37.6
  Bottom 0.102: v17.1,37.6 17.9,38.4 19.1,38.4 19.31,38.19 19.31,37.48 19.48,37.31 19.72,37.31 19.89,37.48 19.89,37.72 20.27,38.1 R27.1
DCMI_SCL  (via drill 0.13)  (1 unrouted)
  Top 0.102: J4.32 14.53,43.53 v14.6,43.6
  Route14 0.102: v14.6,43.6 11.8,40.8 v10.2,40.8
  Bottom 0.102: R30.1 10.3,40.7 v10.2,40.8
DCMI_SCLK  (via drill 0.13)  (1 unrouted)
  Top 0.102: J4.13 19.03,37.63 v19,37.6
DCMI_SDA  (via drill 0.13)  (1 unrouted)
  Top 0.102: J4.34 14.03,43.53 v14.1,43.6
  Route3 0.102: v10.2,42 12.5,42 v14.1,43.6
  Bottom 0.102: R31.1 10.3,41.9 v10.2,42
DCMI_SSEL  (via drill 0.13)  (1 unrouted)
  Top 0.102: J4.11 19.53,37.67 v19.6,37.6
  Bottom 0.102: R24.1 23.95,39.25 23.1,38.4 20,38.4 19.6,38 v19.6,37.6
DCMI_VSYNC  (via drill 0.13)  (1 unrouted)
  Top 0.102: J4.16 18.53,43.57 v18.5,43.6
EN  (via drill 0.25)
  Top 0.254: IC2.5 17.5,3.9 17.1,4.3 v17.1,4.5
  Bottom 0.254: v17.1,4.5 17.1,5.15 | 17.1,5.15 R3.1 | Q1.3 15.9,5.57 16.32,5.15 17.1,5.15
ETH_INT  (via drill 0.2)  (1 unrouted)
  Top 0.203: v12.6,15.8 11.8,15.8 11.35,15.35 IC9.18
  Bottom 0.203: R36.1 v12.6,15.8
ETH_LED
  Top 0.203: R35.1 8.65,16.6 IC9.23
ETH_MDC  (via drill 0.13)  (1 unrouted)
  Top 0.102: IC9.11 10.15,11.16 10.34,10.97 11.16,10.97 11.79,11.6 v12.6,11.6
ETH_MDIO  (via drill 0.13)  (2 unrouted)
  Top 0.102: IC9.10 9.65,11.15 10.03,10.77 11.24,10.77 11.67,11.19 v12.61,11.19
  Bottom 0.102: v12.61,11.19 11.86,11.19 R39.1
ETH_RST  (via drill 0.2)  (1 unrouted)
  Top 0.203: IC9.24 7.55,15.65 7.2,16 R34.1 7.05,17 v6.4,17
  Bottom 0.203: C65.2 v6.4,17
ETH_RXD0  (via drill 0.13)  (1 unrouted)
  Top 0.102: IC9.13 12.55,12.45 v12.6,12.4
ETH_RXD1  (via drill 0.13)  (1 unrouted)
  Top 0.102: IC9.12 11.65,11.75 11.9,12 v12.6,12
ETH_RXDV  (via drill 0.13)  (1 unrouted)
  Top 0.102: IC9.15 12.05,13.45 v12.3,13.7
ETH_RXERR  (via drill 0.13)  (1 unrouted)
  Top 0.102: IC9.17 12.35,14.45 v12.7,14.1
ETH_TXCLK  (via drill 0.13)  (1 unrouted)
  Top 0.102: v12.6,10.81 v12.6,10.8 11.56,10.8 11.06,10.3 8.89,10.3 8.65,10.54 IC9.8
ETH_TXD0  (via drill 0.13)  (1 unrouted)
  Top 0.102: IC9.20 10.15,16.35 v10.4,16.6
ETH_TXD1  (via drill 0.13)  (1 unrouted)
  Top 0.102: IC9.21 9.65,16.35 v9.9,16.6
ETH_TXEN  (via drill 0.13)  (1 unrouted)
  Top 0.102: IC9.19 10.65,16.35 v10.9,16.6
ETH_VDD_1.2  (via drill 0.2)
  Top 0.203: IC9.1 6.85,14.95 v6.6,15.2
  Bottom 0.203: v6.6,15.2 6.85,15.45 C84.1 8.25,15.45 C83.2
ETH_VDDA_3.3  (via drill 0.2)
  Top 0.203: IC9.2 6.75,14.45 v6.6,14.6
  Bottom 0.203: C81.2 8.2,14.55 C82.1 6.65,14.55 v6.6,14.6
  Bottom 0.254: L8.1 8.35,12.95 C85.1 8.25,13.55 C81.2
FB
  Top 0.305: R8.2 15.2,6.1 16.35,6.1 R2.1 16.35,4.4 IC2.1
FEED
  Top 0.35: L7.1 4.4,23.8 | 4.4,23.8 ANT1.1 | C78.1 4.5,23.7 4.4,23.8
GND  (via drill 0.13, 0.15, 0.2, 0.25, 0.3)  (173 unrouted)
  Top 0.102: J4.19 17.53,37.67 v17.6,37.6 | J4.5 21.03,37.63 v21,37.6 | J4.27 15.53,37.63 v15.5,37.6 | IC3.A3 16.1,16.7 v16.4,16.4 | IC3.A1 13.9,16.7 v13.8,16.6 | IC3.J1 14.3,9.9 v14.2,9.8
  Top 0.127: IC3.C3 16.1,15.1 v16.4,14.8 | IC3.E3 16.1,13.5 v16.4,13.2 | v18.6,16.2 18.8,16.2 IC3.B7 | IC3.D7 18.8,14.6 v18.6,14.6
  Top 0.152: FL1.8 25.65,11.4 25.45,11.6 v24.6,11.6 | FL1.5 27.15,11.4 29.65,11.4 R7.2
  Top 0.203: U3.40 7.42,26.62 v7.4,26.6 | U3.42 8.39,26.69 v8.3,26.6 | v3.5,28 3.55,28.05 U3.32 4.21,27.99 U3.33 | v6.1,26.5 6.08,26.52 U3.37 | U3.35 5.17,26.57 v5.1,26.5 | IC9.22 9.15,16.55 v9.2,16.6 | IC5.4 25.6,35.2 26.9,33.9 IC5.9 | C25.1 29.25,27.15 28.9,27.5 IC6.9 26.9,27.5 25.59,28.8 IC6.4 25,29.9 v25,30.6 | C23.1 32.25,33.55 v33,32.8 | C2.1 19.6,7.05 v19.6,8.3 | C22.2 31.9,31.5 32.2,31.2 32.2,28.9 C37.2 | D6.2 34.5,24.55 C35.1 | C24.2 31.45,24.55 C35.1 | C35.1 v33.2,22.6 | v25,25.4 25,26.4 v26,26.4
  Top 0.254: U3.45 5.55,30.2 | 5.55,30.2 v5,30.2 | U3.46 5.55,32.2 v5,32.2 5.17,32.2 U3.19 | U3.43 6.8,30.2 | 6.8,30.2 v7.4,30.2 | U3.44 7.05,32.2 v7.4,32.2 | 7.42,28.05 U3.1 8.39,28.05 U3.42 | 7.42,28.05 U3.40 | U3.4 7.2,29.4 | 7.2,29.4 6.8,29.4 U3.43 | U3.32 5.2,28.05 | 5.2,28.05 5.55,28.05 | 5.55,28.05 U3.45 | U3.35 5.2,27.38 5.2,28.05 | 5.55,28.05 6.08,28.05 | 6.08,28.05 U3.37 | 6.08,28.05 6.8,28.05 | 6.8,28.05 7.42,28.05 | U3.43 6.8,28.05 | 6.8,30.2 6.8,31.3 U3.44 | 5.55,30.2 U3.46 | U3.45 7.2,29.3 7.2,29.4 | U3.46 U3.44 | U3.29 5.55,29.4 U3.45 | U3.21 4.21,33.59 v4,33.8 | U3.12 8.39,33.59 v8.6,33.8 | IC9.22 9.15,13.7 IC9.25
  Top 0.305: D5.2 14.9,4 v15.6,4 15.7,3.9 IC2.2 | C4.1 14.9,4.35 D5.2 | C9.1 13.94,2.05 14.88,1.11 v16.61,1.11 17.5,1.11 C6.2 | D5.2 14.9,4.95 R8.1 | v20.6,4.4 C7.2 19.6,5.4 19.6,6.9 C2.1 | J1.A1_B12 23.15,7.55 R6.2 v22.5,10.2 | R7.2 29.65,7.55 J1.B1_A12 | J8.3 25.98,18.9 D10.2 v23.9,18 24.1,17.8 J8.5 | C37.2 34.4,28.9 | 34.4,28.9 C36.2 | v33.8,29.8 34.4,29.8 34.4,28.9 | v26,38.1 25.59,38.1 IC5.4
  Top 0.35: C78.2 5.43,22.17 5.6,22 5.97,22 J7.2 6.46,22.17 C77.2
  Bottom 0.102: C26.2 16.8,36.03 16.76,36 15.2,36 14.75,36.45 C27.1 | FL5.13 25.7,14.5 v25.8,14.6 | FL4.13 30.3,14.4 v30.5,14.6
  Bottom 0.127: v16.4,14.8 15.95,15.25 C16.2 | C28.2 16.35,13.2 v16.4,13.2 17.65,13.2 C11.1 | C13.2 18.95,16.2 v18.6,16.2 17.8,16.2 C12.2 | v18.6,14.6 18.95,14.6 C19.2 | C30.2 22.5,11.55 v22.5,10.2 | C31.1 20.2,8.9 v19.6,8.3
  Bottom 0.203: v3.5,28 3.55,27.95 C74.2 3.9,27.05 C91.1 5.1,26.75 v5.1,26.5 | C76.2 6.25,26.65 v6.1,26.5 | C93.1 7.4,27.85 v7.4,26.6 | C83.1 9.55,16.6 v9.2,16.6 9.2,17 8.5,17 | C89.2 11.85,13.65 C90.1 12.6,14.5 v12.6,14.8 | C84.2 6.65,15.95 v6.6,16 6.6,15.74 6.22,15.36 6.22,14.44 6.44,14.22 7.23,14.22 C82.2 | 8.5,17 C65.1 | 8.5,17 7.9,17.6 FL2.13 | 12,10.1 12.5,10.1 D8.2 12.5,6.4 12.4,6.4 | CN1.2 10.8,6.4 9.8,7.4 7.7,7.4 7.6,7.3 | 12,36.7 12,37.15 C21.1 10.1,37.7 v10.4,38 | 12,36.7 IC4.9 | v14,36.7 12.8,36.7 | 12.8,36.7 12,36.7 | C20.2 10.05,34.65 v10,34.6 | IC4.4 12.75,36.75 12.8,36.7 | v33,32.8 33.1,32.9 J5.G$2 | R37.2 8.6,34.65 v8.6,33.8 | C14.2 17.7,10.1 v17.8,10 | C29.2 19.6,7.6 v19.6,8.3 | C17.1 v23,15.65 C18.1 | R9.2 6.95,5.4 6.95,7.25 C8.1 | v33.2,22.6 34.55,22.6 J5.G$1 | J5.G$3 25,30.88 v25,30.6 | J5.G$4 25,24.91 v25,25.4 | D9.2 23,18 v23.9,18
  Bottom 0.254: U2.17 10.65,3.05 U2.15 | U2.17 11.15,3.05 U2.6 | U2.17 11.65,3.55 U2.4 12.23,4.24 12.7,4.7 D2.2 12.7,6.4 12.4,6.4 CN1.2 | U2.17 11.65,2.05 U2.8 | R10.2 6.95,1.6 | 6.95,1.6 R9.2 | 6.95,1.6 J3.1 4.14,1.86 D4.2 | IC1.5 17.75,2.45 17.75,3.4 18.5,3.4 | 19.65,3.4 C5.1 | 18.5,3.4 19.65,3.4 | U1.EP 19.59,5.49 U1.2 18.5,5.28 C1.1 18.5,3.4 | v20.6,4.4 19.65,3.45 19.65,3.4 | C27.1 14.1,36.6 v14,36.7 | IC7.3 18.74,35.74 v18.8,35.8 | v2.2,32.2 1.65,32.2 C92.1 1.65,30.2 C75.2 | C81.1 C83.1 | C96.2 C85.2 8.6,10.7 v7.3,10.7 | 7.6,7.42 7.6,7.3 C8.1 | 12,10.1 R38.2
  Bottom 0.305: C10.1 15.1,0.95 IC1.1 16.45,0.95 v16.61,1.11 | C3.1 v15.6,4 16.08,3.52 16.08,2.77 IC1.4 | v16.61,1.11 | C33.1 C52.1 C39.1 16.75,41.55 C40.1 C42.1 15.75,41.55 C44.1 | C51.2 v25.8,43.4 | C32.2 v9.4,43.4 | R27.2 v26,38.1 | J5.P$6 34.42,29.8 v33.8,29.8 | J5.CD$2 v30.2,21.41 v30.2,21.4 FL3.13 | Q6.1 24.02,0.7 D7.2 33.1,0.7 J6.1 | R41.2 30.55,9.7 C110.1 30.55,11.25 30.3,11.5 FL4.13
  other vias: 8.3,26.2 7.4,26.2 8.3,25.8 8.3,25.4 8.3,25 8.3,24.6 8.7,24.2 8.7,23.8 8.7,23.4 8.7,23 8.7,22.6 8.7,22.2 7.4,24.6 7.4,25.8 7.4,25.4 7.4,25 7,24.6 6.6,24.6 5.8,24.6 6.2,24.6 5.4,24.6 5,24.6 5,23 5.4,23 5.8,23 6.2,23 6.6,23 7,23 7.4,23 8.7,24.6 4.6,25 4.6,25.4 4.6,25.8 4.6,26.2 4.6,21 4.6,21.4 4.6,21.8 4.6,22.2 26,28.8 27.6,27.6 29.2,28.8 29.2,26.4 26,32.8 29.2,32.8 29.2,35.2 26,35.2 27.6,34 12,36.6 9.6,14.4
  pour GND (isolate 0.254): 0,0 0,20.8 4.4,20.8 4.4,26.8 0,26.8 0,44.45 35.56,44.45 35.56,0
  pour Top (isolate 0.254): 0.1,0.1 0.1,20.8 4.4,20.8 4.4,26.8 0.1,26.8 0.1,44.35 35.46,44.35 35.46,0.1
  pour Bottom (isolate 0.254): 0.2,0.2 0.2,20.8 4.4,20.8 4.4,26.8 0.2,26.8 0.2,44.25 35.36,44.25 35.36,0.2
ILIM
  Bottom 0.254: U2.12 10.15,0.7 8.25,0.7 R10.1
INT_I2C_INT  (1 unrouted)
  Bottom 0.102: IC7.4 17.56,35.44 17.8,35.2 19.65,35.2 R17.1
INT_I2C_SCL  (1 unrouted)
  Bottom 0.102: R15.1 19.81,36.66 IC7.1 18,37 17.8,37.2 14.34,37.2 14.33,37.2 13.49,37.2 13.2,37.49 13.2,38.4 12.97,38.63 10.33,38.63 9.5,37.8 9.5,34.6 9.9,34.2 12,34.2 12.25,34.45 IC4.6
INT_I2C_SDA  (1 unrouted)
  Bottom 0.102: IC7.5 17.46,36.1 17.37,36.1 17.04,35.77 16.42,35.77 16.05,35.4 R16.1 16.05,35.15 15.5,34.6 14.1,34.6 13.7,35 12.9,35 IC4.5
ISET
  Bottom 0.254: U2.16 8.3,3.55 R12.1
JTAG_TCK  (1 unrouted)
JTAG_TCK_INT  (via drill 0.13)
  Top 0.102: J8.4 28.07,19.07 27.9,18.9 27.9,18 27.9,14 v27.2,13.3
  Bottom 0.102: v27.2,13.3 FL5.9
JTAG_TDI  (1 unrouted)
JTAG_TDI_INT  (via drill 0.13)
  Top 0.102: v27.2,12.3 28.31,13.41 28.31,16.41 28.43,16.53 J8.8
  Bottom 0.102: FL5.11 27,12.5 v27.2,12.3
JTAG_TDO  (1 unrouted)
JTAG_TDO_INT  (via drill 0.13)
  Top 0.102: v27.2,12.8 28.11,13.71 28.11,17.61 28.3,17.8 J8.6
  Bottom 0.102: FL5.10 27.1,12.9 v27.2,12.8
JTAG_TMS  (1 unrouted)
JTAG_TMS_INT  (via drill 0.13)
  Top 0.102: v27.2,13.8 27.7,14.3 27.7,17.2 27.7,20 28.04,20.34 J8.2
  Bottom 0.102: FL5.8 27.1,13.7 v27.2,13.8
JTAG_TRSTB  (1 unrouted)
JTAG_TRSTB_INT  (via drill 0.13)
  Top 0.102: v26.6,14.6 26.6,15.2 26.54,15.26 J8.9
  Bottom 0.102: FL5.7 26.5,14.5 v26.6,14.6
LED_B  (via drill 0.13)  (1 unrouted)
  Top 0.102: R19.1 1,32.85 v1,33.4
LED_B_INT
  Top 0.203: D3.1 1.45,31.1 R19.2
LED_CHG  (via drill 0.13)
  Top 0.102: D1.3 32.7,32 v32.8,32.1 | v13.9,7.4 R1.2
  Route3 0.102: v13.9,7.4 13.9,6.6 18.29,2.21 20.67,2.21 21.47,1.41 31.52,1.41 32.09,1.98 32.09,29.79 32.3,30 32.35,30.05 32.8,30.5 v32.8,32.1
LED_G  (via drill 0.13)  (1 unrouted)
  Top 0.102: R20.1 1,28.95 0.8,28.75 v0.8,28.3
LED_G_INT
  Top 0.203: R20.2 1.45,30.5 D3.2
LED_PGOOD  (via drill 0.13, 0.25)
  Top 0.102: D1.2 33.3,32 v33.2,32.1
  Route3 0.102: v15.6,3.2 16.4,3.2 17.6,2 20.59,2 21.38,1.21 31.61,1.21 32.29,1.89 32.29,20 32.29,20.18 32.29,29.71 33.2,30.61 v33.2,32.1
  Bottom 0.254: R4.2 15.35,3.2 v15.6,3.2
LED_R  (via drill 0.13)  (1 unrouted)
  Top 0.102: R21.1 1.15,28.15 v0.8,27.8
LED_R_INT
  Top 0.203: R21.2 2.9,29.95 D3.3
LED_ST  (via drill 0.13, 0.25)
  Top 0.102: D1.1 33.3,29.9 v33.2,29.8
  Route3 0.102: v20.6,1.2 21,0.8 31.8,0.8 32.7,1.7 32.7,29.29 33.09,29.68 33.09,29.69 v33.2,29.8
  Bottom 0.254: v20.6,1.2 R5.2
MDI_LED
  Top 0.102: J3.8 7.82,19.38 8.4,18.8 R35.2
MDI_RX_N
  Top 0.127: J3.7 5.57,15.41 5.57,14.67 6.29,13.95 IC9.3
MDI_RX_P
  Top 0.127: J3.6 5.46,14.3 5.5,14.34 5.58,14.34 6.47,13.45 IC9.4
MDI_TX_N
  Top 0.127: J3.5 4.83,12.45 6.26,12.45 6.76,12.95 IC9.5
MDI_TX_P
  Top 0.127: J3.4 5.8,10.88 5.8,11.95 6.08,12.22 6.35,12.22 6.6,12.46 6.63,12.46 6.64,12.45 IC9.6
NVCC_PLL  (2 unrouted)
ONOFF  (via drill 0.13)  (1 unrouted)
  Bottom 0.102: Q3.2 8.35,10.05 v8.4,10
P0_MOSI  (1 unrouted)
P0_MOSI_INT
  Bottom 0.102: FL2.12 5.2,20.2 4.8,20.6 2.82,20.6 J2.8
P1_MISO  (1 unrouted)
P1_MISO_INT
  Bottom 0.102: FL2.11 6.5,19.8 4.8,18.1 2.86,18.1 J2.7
P2_SCLK  (1 unrouted)
P2_SCLK_INT
  Bottom 0.102: J2.6 2.85,15.55 2.9,15.6 4.8,15.6 5.4,16.2 5.4,18.41 6.39,19.4 FL2.10
P3_NSS  (1 unrouted)
P3_NSS_INT
  Bottom 0.102: FL2.9 6.28,19 5.64,18.36 5.6,18.33 5.6,16.1 5.4,15.9 5.4,13.6 4.8,13 2.84,13 J2.5
P4_SCL  (1 unrouted)
P4_SCL_INT
  Bottom 0.102: FL2.8 6.16,18.6 5.81,18.24 5.81,16.02 5.6,15.82 5.6,11.3 4.8,10.5 2.88,10.5 J2.4
P5_SDA  (1 unrouted)
P5_SDA_INT
  Bottom 0.102: J2.3 2.9,7.98 4.78,7.98 5.4,8.6 5.4,10.8 5.81,11.21 5.81,15.73 6.01,15.94 6.01,18 6.21,18.2 FL2.7
P6_ADC  (1 unrouted)
P6_ADC_INT  (via drill 0.13)
  Route3 0.102: v31.4,11.4 31.89,10.91 31.89,2.06 31.44,1.61 21.55,1.61 20.75,2.41 18.39,2.41 14.19,6.61 14.19,7.52 14.02,7.69 13.78,7.69 13.61,7.52 13.61,6.01 13,5.4 2.86,5.4 J2.2
  Bottom 0.102: FL4.12 31.1,11.7 v31.4,11.4
P7_PWM  (1 unrouted)
P7_PWM_INT
  Bottom 0.102: FL4.11 31.8,12.5 32.4,11.9 32.4,8.28 J6.3
P8_PWM  (1 unrouted)
P8_PWM_INT
  Bottom 0.102: FL4.10 31.9,12.9 32.7,12.1 32.7,10.52 J6.4
P9_PWM  (1 unrouted)
P9_PWM_INT
  Bottom 0.102: FL4.9 32.46,13.3 J6.5
P10_PWM  (via drill 0.13)
  Route3 0.102: v26,40 27.2,40 30.4,36.8 30.4,33 31.89,31.51 31.89,16.69 29.2,14 v28.8,14
  Bottom 0.102: R26.1 22.9,40.8 22.6,40.5 Q4.3 22.7,40 v26,40 | FL4.5 28.8,13.7 v28.8,14
P10_PWM_INT
  Bottom 0.102: J6.6 32.5,14.3 31.9,13.7 FL4.8
P11_WAKEUP
  Bottom 0.102: R22.1 27.65,16.15 27.8,16 Q2.3 31,15.4 30.6,15 30,15 29.5,14.5 FL4.6
P11_WAKEUP_INT
  Bottom 0.102: J6.7 31.96,14.8 31.3,14.8 31.1,14.6 FL4.7
P12_RST_N  (3 unrouted)
P12_RST_N_EXT  (via drill 0.13)
  Top 0.102: v27.2,11.8 30.02,14.62 J8.10 31.76,15.26 32.7,16.2 32.7,18.08 J6.8
  Bottom 0.102: FL5.12 26.99,12.1 27.2,11.89 v27.2,11.8
P_FLASH_CE  (1 unrouted)
  Top 0.203: R13.2 29.41,37.05 IC5.1
P_FLASH_IO0  (1 unrouted)
P_FLASH_IO1  (1 unrouted)
P_FLASH_IO2  (1 unrouted)
P_FLASH_IO3  (1 unrouted)
P_FLASH_SCK  (1 unrouted)
PGOOD
  Bottom 0.127: 13.55,2.65 R4.1
  Bottom 0.203: U2.7 13.45,2.55
  Bottom 0.254: 13.45,2.55 13.55,2.65
PMIC_ON_REQ  (1 unrouted)
PMIC_ONOFF
  Bottom 0.102: J3.3 6.86,9.4 Q3.3
  Bottom 0.203: Q3.3 9.5,8.95 R23.1 11.7,8.95 D8.1
PWM_FSIN  (1 unrouted)
  Bottom 0.203: R25.1 19.95,40 20.4,40 Q4.2
  Bottom 0.305: R25.1 18.8,39.65 Q5.2
RAW  (via drill 0.13, 0.25)  (2 unrouted)
  Top 0.102: v32.8,29.8 32.7,29.9 D1.4
  Top 0.305: D5.1 14.9,3.05 C4.2 13.25,3.05 12.8,2.6 12.8,1.3 12.43,0.93 10.77,0.93 9.6,2.1 5.78,2.1 4.14,3.74 J3.2 | D5.1 14.9,3.1 | D5.1 14.9,2 C6.1 16.6,2 | 16.6,2 v16.6,1.8 | IC2.3 16.6,3.4 16.6,2
  Route3 0.102: v16.6,1.8 20.5,1.8 20.74,1.56 20.75,1.56 21.3,1 31.7,1 32.5,1.8 32.5,29.5 v32.8,29.8
  Route14 0.102: v29,14.6 32.5,18.1 32.5,29.5 v32.8,29.8
  Bottom 0.102: R22.2 26.35,16.15 26.5,16 27.5,16 28.15,15.35 Q2.1 29,15.15 v29,14.6
  Bottom 0.203: J3.2 6.4,6.4 6.4,8.4 6.75,8.75 Q3.1 8.85,8.75 9.85,7.75 10.7,7.75 R23.2
  Bottom 0.254: v16.6,1.8 16.6,1.81 16.92,2.13 16.92,4.02 15.59,5.35 15.2,5.35 | Q1.1 15.2,5.35 | 15.2,5.35 15.2,6.5 17.2,6.5 R3.2 C1.2 19.59,6.45 U1.3 U1.4
  Bottom 0.305: IC1.2 16.25,1.45 v16.6,1.8 16.95,1.45 IC1.7
REXT  (via drill 0.13)
  Top 0.102: v9,10.7 9.15,10.85 IC9.9
  Bottom 0.102: v9,10.7 9,10.2 9.1,10.1 R38.1
RTC_XTALI  (2 unrouted)
RTC_XTALO  (2 unrouted)
S_FLASH_CE  (1 unrouted)
  Top 0.203: R14.2 31.25,29.8 29.5,29.8 IC6.1
S_FLASH_IO0  (1 unrouted)
S_FLASH_IO1  (1 unrouted)
S_FLASH_IO2  (1 unrouted)
S_FLASH_IO3  (1 unrouted)
S_FLASH_SCK  (1 unrouted)
SD_CD  (1 unrouted)
  Bottom 0.102: 24.6,21.63 J5.CD$1 24.82,20.43 24.46,20.06 RN1.9
  Bottom 0.203: RN1.9 24.41,19.2 D9.1
SD_CLK  (via drill 0.13)  (1 unrouted)
  Bottom 0.102: FL3.4 29.1,19.1 28.4,19.8 v28.2,19.8
SD_CLK_INT
  Bottom 0.152: FL3.9 31.58,19.1 31.9,19.42 31.9,27.5 32.84,28.44 J5.P$5
SD_CMD  (1 unrouted)
  Bottom 0.102: FL3.3 29.1,18.7 29.01,18.61 26.3,18.61 26.05,18.86 RN1.12
SD_CMD_INT
  Bottom 0.152: J5.P$3 33.54,26.24 32.19,24.89 32.19,19.35 31.54,18.7 FL3.10
SD_DAT0  (1 unrouted)
  Bottom 0.102: FL3.5 29.1,19.5 28.4,20.2 27.3,20.2 27.05,19.95 RN1.14
SD_DAT0_INT
  Bottom 0.152: J5.P$7 33.14,30.64 31.65,29.15 31.65,19.62 31.52,19.5 FL3.8
SD_DAT1  (1 unrouted)
  Bottom 0.102: FL3.6 29.1,19.9 28.5,20.5 27.1,20.5 26.55,19.95 RN1.13
SD_DAT1_INT
  Bottom 0.152: FL3.7 31.39,19.9 31.39,29.29 33.79,31.69 J5.P$8
SD_DAT2  (1 unrouted)
  Bottom 0.102: FL3.1 29.1,17.9 28.8,18.2 25.2,18.2 25.05,18.35 RN1.10
SD_DAT2_INT
  Bottom 0.152: FL3.12 31.5,17.9 32.7,19.1 32.7,23.1 33.64,24.04 J5.P$1
SD_DAT3  (1 unrouted)
  Bottom 0.102: FL3.2 29.09,18.3 28.98,18.4 25.7,18.4 25.55,18.55 RN1.11
SD_DAT3_INT
  Bottom 0.152: J5.P$2 33.64,25.14 32.45,23.95 32.45,19.25 31.5,18.3 FL3.11
SDRAM_A0  (1 unrouted)
SDRAM_A1  (1 unrouted)
SDRAM_A2  (1 unrouted)
SDRAM_A3  (1 unrouted)
SDRAM_A4  (1 unrouted)
SDRAM_A5  (1 unrouted)
SDRAM_A6  (1 unrouted)
SDRAM_A7  (1 unrouted)
SDRAM_A8  (1 unrouted)
SDRAM_A9  (1 unrouted)
SDRAM_A10  (1 unrouted)
SDRAM_A11  (1 unrouted)
SDRAM_A12  (1 unrouted)
SDRAM_BA0  (1 unrouted)
SDRAM_BA1  (1 unrouted)
SDRAM_CAS  (1 unrouted)
SDRAM_CKE  (1 unrouted)
SDRAM_CLK  (1 unrouted)
SDRAM_CS  (1 unrouted)
  Top 0.102: R18.2 22.25,12.65 21.5,11.9 IC3.G9
SDRAM_DQ0  (1 unrouted)
SDRAM_DQ1  (1 unrouted)
SDRAM_DQ2  (1 unrouted)
SDRAM_DQ3  (1 unrouted)
SDRAM_DQ4  (1 unrouted)
SDRAM_DQ5  (1 unrouted)
SDRAM_DQ6  (1 unrouted)
SDRAM_DQ7  (1 unrouted)
SDRAM_DQ8  (1 unrouted)
SDRAM_DQ9  (1 unrouted)
SDRAM_DQ10  (1 unrouted)
SDRAM_DQ11  (1 unrouted)
SDRAM_DQ12  (1 unrouted)
SDRAM_DQ13  (1 unrouted)
SDRAM_DQ14  (1 unrouted)
SDRAM_DQ15  (1 unrouted)
SDRAM_DQMH  (1 unrouted)
SDRAM_DQML  (1 unrouted)
SDRAM_RAS  (1 unrouted)
SDRAM_WE  (1 unrouted)
SHELL_GND
  Bottom 0.305: J1.S1 J1.S2 J1.S3 J1.S4 29.75,6.98 29.75,9 R41.1 29.25,9.7 C110.2
SR_VLX  (via drill 0.2)
  Top 0.203: U3.34 4.72,26.9 3.9,26.9 v3.4,27.4
  Bottom 0.203: v3.4,27.4 2.05,27.4 L9.1
ST
  Bottom 0.305: IC1.8 18.1,0.95 R5.1
SW
  Top 0.305: L2.1 18.2,1.65 18.2,3.4 IC2.4
TMR
  Bottom 0.254: U2.14 8.4,2.55 R11.1
TS
  Bottom 0.254: U2.1 8.81,4.24 R9.1
USB_D_N  (1 unrouted)
USB_D_P  (1 unrouted)
USB_VBUS  (via drill 0.15, 0.3)
  Top 0.152: FL1.4 27.15,9.55 v27.7,9
  Top 0.305: v23.9,9 23.9,7.66 J1.A4_B9 | v28.9,9 28.9,7.66 J1.B4_A9
  Bottom 0.152: v27.7,9 27.7,9.5
  Bottom 0.305: v28.9,9 28.4,9.5 27.7,9.5 24.4,9.5 v23.9,9 L1.1
V_BATT
  Bottom 0.254: U2.11 10.9,1.36 U2.10 | U2.5 13.1,3.55 C3.2 14.35,4.8 15.5,4.8 16.54,3.76 16.54,2.39 16.1,1.95 IC1.3
  Bottom 0.305: 10.9,1.36 10.9,0.6 13.55,0.6 C10.2 14.3,1.95 IC1.3
VBUS  (via drill 0.15, 0.3)  (3 unrouted)
  Top 0.152: FL1.1 25.65,9.5 25.6,9.5 v25.1,9
  Top 0.305: v9.4,1.5 10.4,0.5 13.65,0.5 C9.2 13.9,0.6 20.68,0.6 21.08,1 21.08,3.32 v20.8,3.6
  Bottom 0.152: v25.1,9 24.4,8.3 21.31,8.3 21.21,8.4
  Bottom 0.254: 21.2,8.85 L1.2 21.21,8.86 21.21,8.4 21.21,4.01
  Bottom 0.305: U2.13 9.46,1.56 v9.4,1.5 | v20.8,3.6 21.21,4.01
VCC  (via drill 0.13, 0.2, 0.25, 0.3)  (54 unrouted)
  Top 0.102: J4.36 13.53,43.57 v13.5,43.6 | J4.30 15.03,43.57 v15,43.6 | J4.20 17.53,43.53 v17.6,43.6 | J4.10 20.03,43.57 v20,43.6 | J4.2 22.03,43.57 v22,43.6 | R18.1 22.25,11.35 21.2,10.3 IC3.J9
  Top 0.127: IC3.B3 16.1,15.9 v16.4,15.6 | IC3.D3 16.1,14.3 v16.4,14 | IC3.A7 19,16.8 v18.6,16.8 | IC3.C7 19,15.2 v18.6,15.2 | IC3.E7 19,13.6 v18.6,13.6 | IC3.A9 v20.7,17.2 | IC3.J9 20.7,9.9 v20.6,9.8
  Top 0.203: U3.30 3.75,28.95 v3.5,29.2 | v5.6,26.6 5.62,26.62 U3.36 | v12.4,13.2 12.15,12.95 IC9.14 | R34.2 7.05,18.15 6.7,17.8 v6.4,17.8 | IC6.8 v30.2,25.1 C24.1 30.95,25.85 C25.2 32.2,26.55 32.2,27.1 | 31.35,28.25 R14.1 32.2,27.55 32.2,27.1 | C23.2 30.95,32.25 | 30.95,32.25 C22.1 v30.2,31.5 IC5.8 | R13.1 30.05,33.15 30.95,32.25 | 32.2,27.1 C37.1 33.2,27.2 | 34.4,27.2 D6.1
  Top 0.254: D3.4 2.9,32.1 v3,32.2
  Top 0.305: IC2.6 18.8,4.4 | 18.8,4.4 v19.4,4.4 L2.2 | 18.8,4.4 C7.1 18.8,5.6 R2.2 | 23.9,20.4 25.92,20.4 J8.1 | D10.1 23.9,20.4 | 23.9,20.4 v23.4,20.4 | C35.2 C37.1 33.4,27.3 v33.4,27.8 | 33.2,27.2 34.4,27.2 C36.1
  Bottom 0.102: v15,43.6 15,43.3 14.45,42.75 C42.2 | 17.6,43.5 v17.6,43.6 17.6,43.25 18.05,42.8 C40.2 | v20,43.6 19.25,42.85 C39.2 | v22,43.6 22,43.05 C33.2 | v13.5,43.6 13.5,42.85 C44.2 | R25.2 19.6,40.95 20.84,40.95 20.93,40.86 20.93,39.63 20.55,39.25 Q4.1 | IC7.6 17.45,36.55 C26.1 16.1,36.55 C27.2
  Bottom 0.127: v16.4,15.6 16.25,15.75 C16.1 | v16.4,14 16.25,14.15 C28.1 | v18.6,15.2 18.85,15.2 C19.1 | v18.6,16.8 18.85,16.8 C13.1 | v18.6,13.6 18.25,13.6 C11.2 | C15.1 v20.7,17.2 21.5,17.2 C17.2 | C31.2 20.45,9.65 v20.6,9.8 21.05,10.25 C30.1
  Bottom 0.203: v5.6,26.6 5.75,26.75 C76.1 5.75,27.8 C93.2 | C75.1 3.16,29.56 3.5,29.21 v3.5,29.2 | C96.1 10.35,13.15 C89.1 11.8,13.15 | 11.8,13.15 12.35,13.15 v12.4,13.2 | R39.2 11.8,13.15 | C20.1 10.5,35.85 C21.2 | IC4.8 C20.1 | C20.1 10.45,35.2 v10,35.2 | C12.1 18.15,14.25 C11.2 18.15,12.5 C14.1 | C31.2 19.35,9.65 C29.1 | C17.2 22.85,16.95 C18.2 24.1,16.8 24.46,17.16 RN1.8 RN1.7 RN1.6 RN1.5 RN1.4 RN1.3 RN1.2 RN1.1
  Bottom 0.254: R16.2 14.2,35.3 v14,35.5 | v22,36.8 21.25,36.8 R15.2 R17.2 | C75.1 3.15,30.9 C92.2 2.95,32.15 v3,32.2 3,32.72 3.48,33.2 5.29,33.2 RN2.1 RN2.2 RN2.3 RN2.4 RN2.5 RN2.6 RN2.7 RN2.8 5.75,28.2 C93.2 | L8.2 7.85,12.3 9.2,12.3 10.05,13.15 10.35,13.15 10.55,13.35 C90.2 R36.2 | D4.1 1.6,1.8 J2.1
  Bottom 0.305: L4.2 v25.2,42 25.2,40.8 R26.2 | C32.1 12.15,43.4 12.15,43 13.3,43 C44.2 14.3,42.85 C42.2 | R30.2 R31.2 12.15,43.25 C32.1 | C32.1 12.2,43.6 v12.8,43.6 | C40.2 18.2,42.85 C39.2 | 12.15,40.45 R30.2 | 13.3,40.45 R29.2 | R30.2 12.3,40.55 R29.2 | R29.2 R28.2 15,40.95 Q5.1 18.4,40.55 R25.2 | v26,39.3 R24.2 | J5.P$4 33.86,27.34 v33.4,27.8
  pour VCC (isolate 0.254): 0.41,0.4 0.41,20.8 4.4,20.8 4.4,26.8 0.4,26.8 0.38,26.82 0.38,44.07 35.18,44.07 35.18,0.4
VCC_SOC  (23 unrouted)
VDD_HIGH_CAP  (2 unrouted)
VDD_SNVS  (via drill 0.25)  (2 unrouted)
  Top 0.254: v20.7,7.8 20.7,6.95 C2.2
  Bottom 0.254: U1.1 20.7,5.28 v20.7,7.8
VDD_SNVS_CAP  (1 unrouted)
VDD_USB_CAP  (3 unrouted)
VDDA  (via drill 0.13)
  Top 0.102: J4.4 21.53,43.57 v21.5,43.6
  Bottom 0.102: C52.2 20.5,43.4 20.7,43.6 v21.5,43.6 21.8,43.9 22.8,43.9 23.1,43.6 C51.1
  Bottom 0.305: L4.1 23.1,42.15 C51.1
VDDA_ADC_3P3  (4 unrouted)
VIN
  Bottom 0.305: J6.2 31.26,1.4 25.7,1.4 D7.1 25.55,1.55 Q6.3
VIN_INT  (1 unrouted)
  Bottom 0.305: IC1.6 20.75,1.95 22.05,0.65 Q6.2
VIN_LDO  (via drill 0.2)
  Top 0.203: U3.31 3.5,28.5 v3.4,28.6
  Bottom 0.203: L9.2 2.45,28.6 v3.4,28.6 3.55,28.45 C74.1 4.7,28.45 C91.2
WAKEUP  (1 unrouted)
WIFI_CLK  (via drill 0.13)  (1 unrouted)
  Top 0.102: U3.20 4.72,33.67 v4.6,33.8
WIFI_CMD  (via drill 0.13)  (1 unrouted)
  Top 0.102: U3.22 3.85,32.55 v3.6,32.8
  Bottom 0.102: RN2.16 3.66,32.74 v3.6,32.8
WIFI_D0  (via drill 0.13)  (1 unrouted)
  Top 0.102: U3.24 3.75,31.65 v3.6,31.8
  Bottom 0.102: v3.6,31.8 3.75,31.65 RN2.14
WIFI_D1  (via drill 0.13)  (1 unrouted)
  Top 0.102: U3.26 3.65,30.75 v3.6,30.8
  Bottom 0.102: RN2.12 4.2,30.7 3.7,30.7 v3.6,30.8
WIFI_D2  (via drill 0.13)  (1 unrouted)
  Top 0.102: v3.6,32.3 3.8,32.1 U3.23
  Bottom 0.102: RN2.15 3.75,32.15 v3.6,32.3
WIFI_D3  (via drill 0.13)  (1 unrouted)
  Top 0.102: v3.6,31.3 3.7,31.2 U3.25
  Bottom 0.102: RN2.13 3.75,31.15 v3.6,31.3
WL_H_WAKE  (via drill 0.13)  (1 unrouted)
  Top 0.102: U3.27 3.7,30.3 v3.6,30.4
WL_REG_ON  (via drill 0.13)  (1 unrouted)
  Top 0.102: U3.28 3.75,29.85 v3.6,30
XTALI  (3 unrouted)
XTALO  (2 unrouted)

## Text on the board
tPlace: P0 | https://openmv.io | RST | P1 | WAKE | P2 | P10 | P3 | P9 | P4 | 3.7V LiPo | OpenMV RT R1 | P8 | 3.21.23 | P5 | P7 | P6 | VIN | GND | 3.3V
bPlace: IR | W | P0 | RST | ELED / ERXN / ERXP / ETXN / ETXP / PBTN / RAW / GND | P1 | WAKE | P2 | P10 | P3 | P9 | P4 | P8 | I/Os 3.3V / Tolerant | VIN 5V Max | P5 | P7 | P6 | VIN | GND | 3.3V